# EAGLE schematic imix (EAGLE 7.5.0)
AUTHOR: Shane Leonard; REVISION: 1.2

## Sheet 1 of 8: MCU
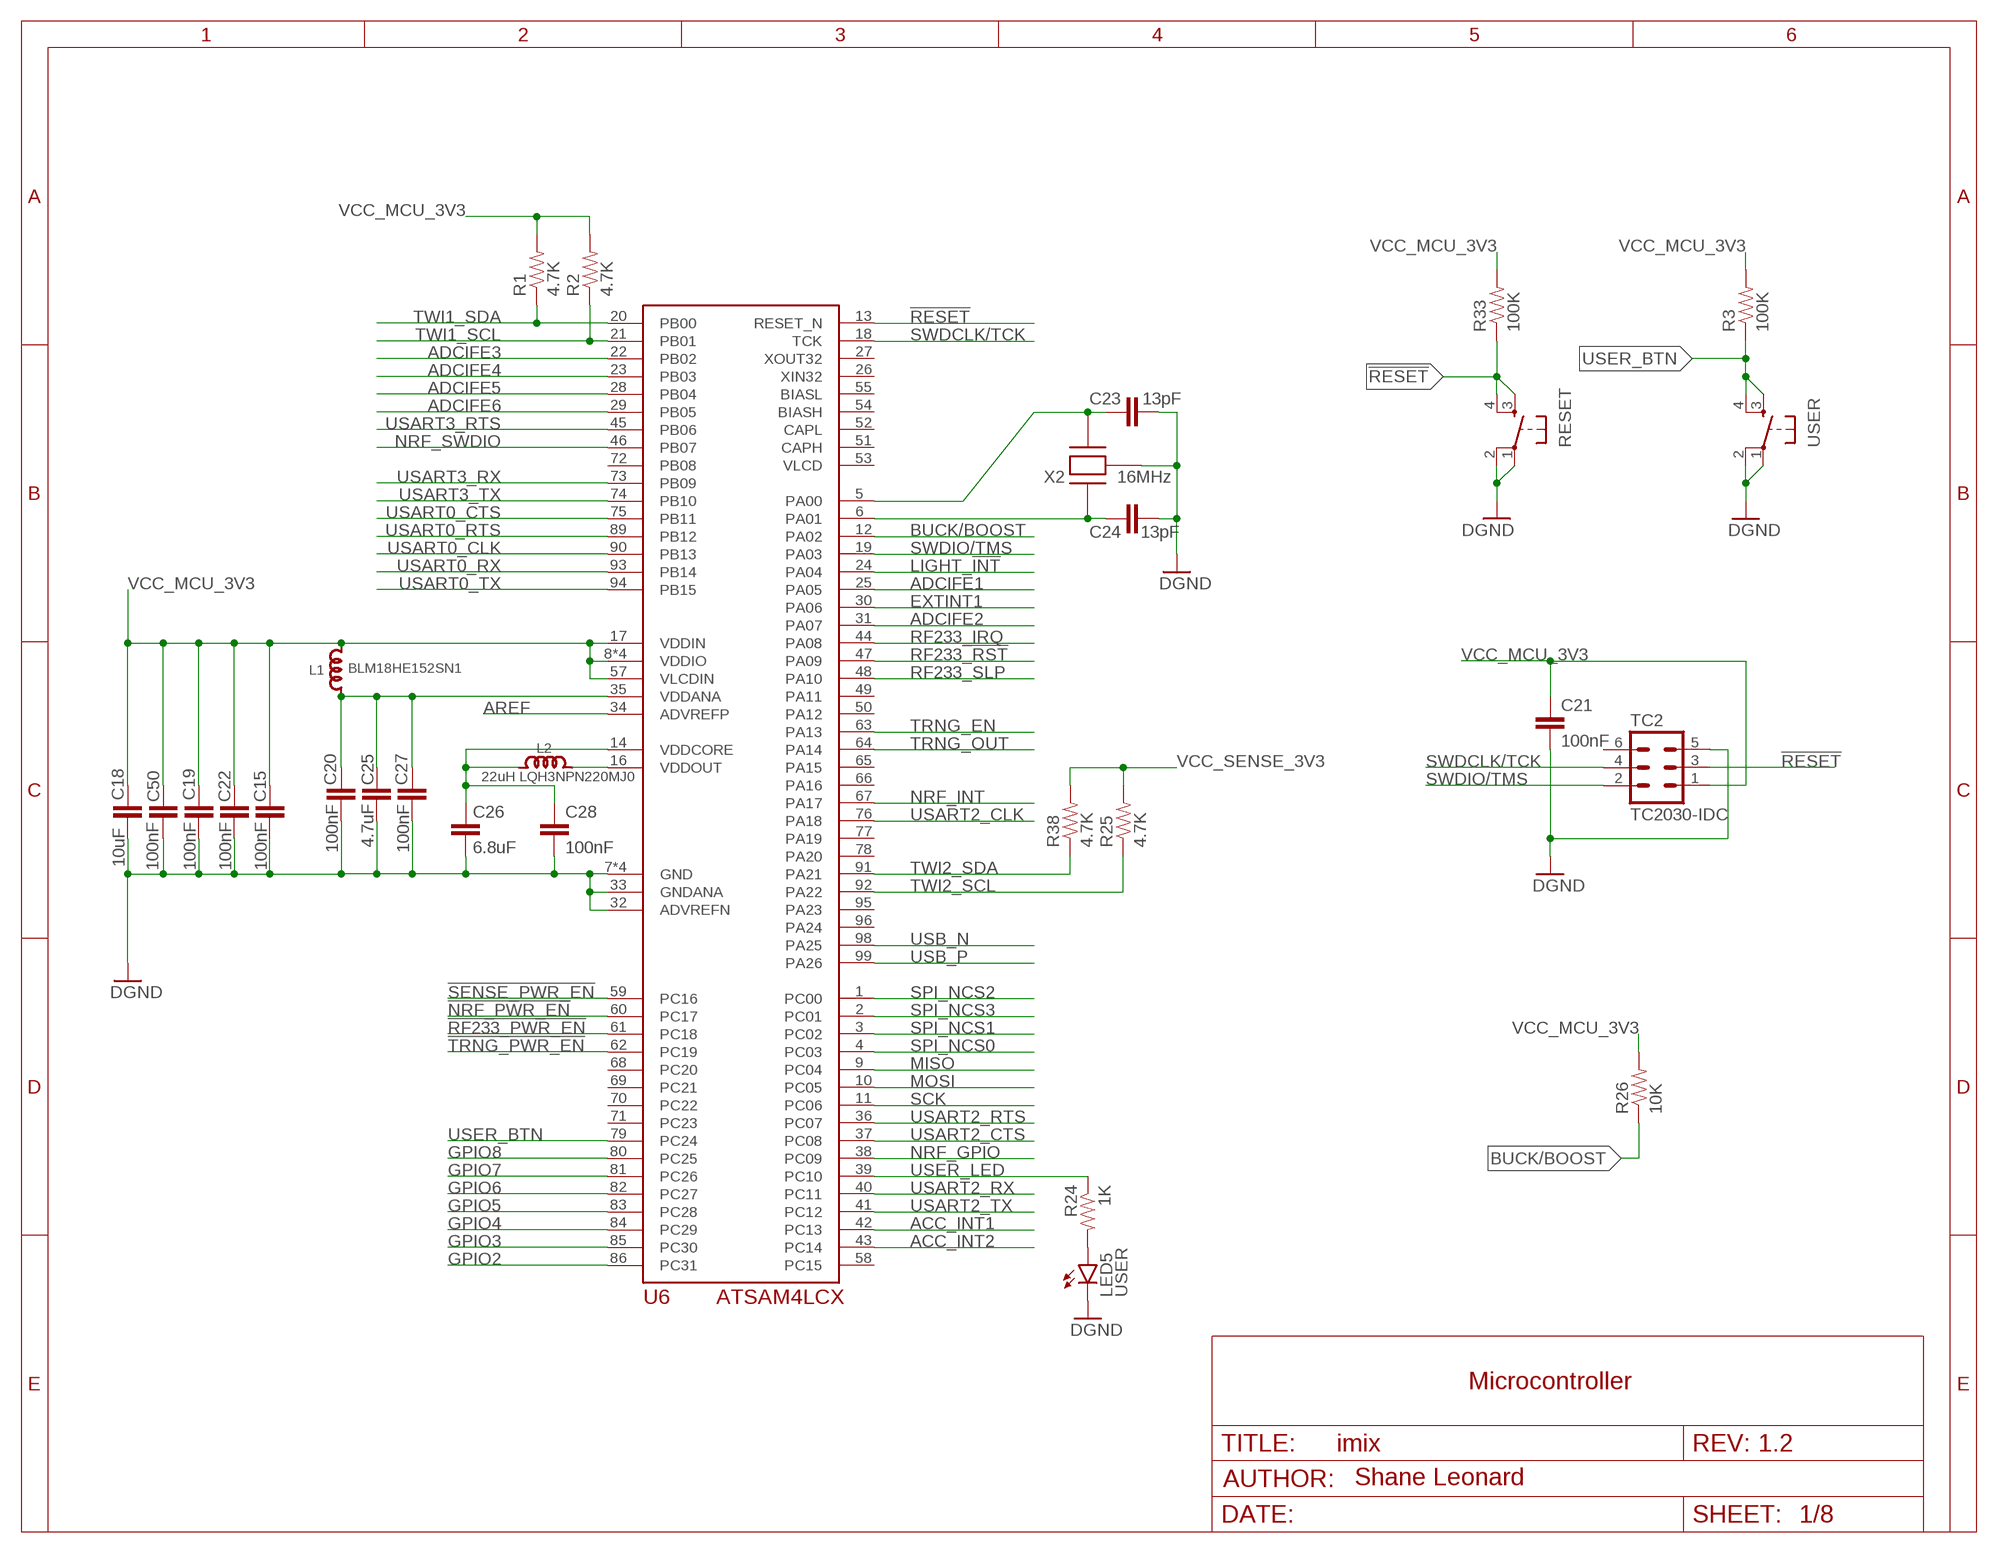
[diagram p0: schematic, sheet 1]

### Parts
C15  100nF  C-EUC0603  [C0603]
C18  10uF  C-EUC0603  [C0603]
C19  100nF  C-EUC0603  [C0603]
C20  100nF  C-EUC0603  [C0603]
C21  100nF  C-EUC0603  [C0603]
C22  100nF  C-EUC0603  [C0603]
C23  13pF  C-EUC0603  [C0603]
C24  13pF  C-EUC0603  [C0603]
C25  4.7uF  C-EUC0603  [C0603]
C26  6.8uF  C-EUC0603  [C0603]
C27  100nF  C-EUC0603  [C0603]
C28  100nF  C-EUC0603  [C0603]
C50  100nF  C-EUC0603  [C0603]
L1  BLM18HE152SN1  L  [L0603]
L2  22uH LQH3NPN220MJ0  L1212  [L1212]
LED5  USER  LED-BLUE0603  [LED-0603]
R1  4.7K  RESISTOR0603-RES  [0603-RES]
R2  4.7K  RESISTOR0603-RES  [0603-RES]
R3  100K  RESISTOR0603-RES  [0603-RES]
R24  1K  RESISTOR0603-RES  [0603-RES]
R25  4.7K  RESISTOR0603-RES  [0603-RES]
R26  10K  RESISTOR0603-RES  [0603-RES]
R33  100K  RESISTOR0603-RES  [0603-RES]
R38  4.7K  RESISTOR0603-RES  [0603-RES]
RESET  TAC_SWITCHSMD  [TACTILE-SWITCH-SMD]
TC2  TC2030-IDC  [TC2030-IDC]
U6  ATSAM4LCX_100  [TQFP100]
USER  TAC_SWITCHSMD  [TACTILE-SWITCH-SMD]
X2  16MHz  XTAL_GROUNDED5X3.2MM  [CTS_405_SERIES]

### Nets
!NRF_PWR_EN: U6.60(PC17) ; also sheet 2,6
!RESET: R33.1 RESET.3 RESET.4 TC2.3 U6.13(RESET_N) ; also sheet 2,5
!RF233_PWR_EN: U6.61(PC18) ; also sheet 2,6
!SENSE_PWR_EN: U6.59(PC16) ; also sheet 2,6
!TRNG_PWR_EN: U6.62(PC19) ; also sheet 6
ACC_INT1: U6.42(PC13) ; also sheet 2,7
ACC_INT2: U6.43(PC14) ; also sheet 2,7
ADCIFE1: U6.25(PA05) ; also sheet 2
ADCIFE2: U6.31(PA07) ; also sheet 2
ADCIFE3: U6.22(PB02) ; also sheet 2
ADCIFE4: U6.23(PB03) ; also sheet 2
ADCIFE5: U6.28(PB04) ; also sheet 2
ADCIFE6: U6.29(PB05) ; also sheet 2
AREF: U6.34(ADVREFP) ; also sheet 2
BUCK/BOOST: R26.1 U6.12(PA02)
EXTINT1: U6.30(PA06) ; also sheet 2
GND: C15.1 C18.1 C19.1 C20.2 C21.2 C22.1 C23.2 C24.2 C25.2 C26.2 C27.2 C28.2 C50.1 LED5.C RESET.1 RESET.2 TC2.5 U6.7(GND) U6.15(GND) U6.32(ADVREFN) U6.33(GNDANA) U6.56(GND) U6.100(GND) USER.1 USER.2 X2.CASE@2(CASE) X2.CASE@4(CASE) ; supply symbol labelled DGND ; also sheet 2,3,4,5,6,7,8
GPIO2: U6.86(PC31) ; also sheet 2
GPIO3: U6.85(PC30) ; also sheet 2
GPIO4: U6.84(PC29) ; also sheet 2
GPIO5: U6.83(PC28) ; also sheet 2
GPIO6: U6.82(PC27) ; also sheet 2
GPIO7: U6.81(PC26) ; also sheet 2
GPIO8: U6.80(PC25) ; also sheet 2
LIGHT_!INT: U6.24(PA04) ; also sheet 2,7
MCU_VOUT3.3: L2.2 U6.16(VDDOUT)
MISO: U6.9(PC04) ; also sheet 2,3
MOSI: U6.10(PC05) ; also sheet 2,3
N$10: C20.1 C25.1 C27.1 L1.1 U6.35(VDDANA)
N$11: C24.1 U6.6(PA01) X2.1
N$12: C26.1 C28.1 L2.1 U6.14(VDDCORE)
N$13: C23.1 U6.5(PA00) X2.3
N$29: LED5.A R24.2
NRF_GPIO: U6.38(PC09) ; also sheet 2,4
NRF_INT: U6.67(PA17) ; also sheet 2,4
NRF_SWDIO: U6.46(PB07) ; also sheet 2,4
RF233_!RST: U6.47(PA09) ; also sheet 2,3
RF233_IRQ: U6.44(PA08) ; also sheet 2,3
RF233_SLP: U6.48(PA10) ; also sheet 2,3
SCK: U6.11(PC06) ; also sheet 2,3
SPI_NCS0: U6.4(PC03) ; also sheet 2
SPI_NCS1: U6.3(PC02) ; also sheet 2
SPI_NCS2: U6.1(PC00) ; also sheet 2
SPI_NCS3: U6.2(PC01) ; also sheet 2,3
SWDCLK/TCK: TC2.4 U6.18(TCK)
SWDIO/TMS: TC2.2 U6.19(PA03)
TRNG_EN: U6.63(PA13) ; also sheet 2,8
TRNG_OUT: U6.64(PA14) ; also sheet 2,8
TWI1_SCL: R2.1 U6.21(PB01) ; also sheet 2
TWI1_SDA: R1.1 U6.20(PB00) ; also sheet 2
TWI2_SCL: R25.1 U6.92(PA22) ; also sheet 2,4,7
TWI2_SDA: R38.1 U6.91(PA21) ; also sheet 2,4,7
USART0_CLK: U6.90(PB13) ; also sheet 2
USART0_CTS: U6.75(PB11) ; also sheet 2
USART0_RTS: U6.89(PB12) ; also sheet 2
USART0_RX: U6.93(PB14) ; also sheet 2
USART0_TX: U6.94(PB15) ; also sheet 2
USART2_CLK: U6.76(PA18) ; also sheet 2,4
USART2_CTS: U6.37(PC08) ; also sheet 2,4
USART2_RTS: U6.36(PC07) ; also sheet 2,4
USART2_RX: U6.40(PC11) ; also sheet 2,4
USART2_TX: U6.41(PC12) ; also sheet 2,4
USART3_RTS: U6.45(PB06) ; also sheet 2,5
USART3_RX: U6.73(PB09) ; also sheet 2,5
USART3_TX: U6.74(PB10) ; also sheet 2,5
USB_N: U6.98(PA25) ; also sheet 5
USB_P: U6.99(PA26) ; also sheet 5
USER_BTN: R3.1 U6.79(PC24) USER.3 USER.4 ; also sheet 2
USER_LED: R24.1 U6.39(PC10) ; also sheet 2
VCC_MCU_3V3 [power]: C15.2 C18.2 C19.2 C21.1 C22.2 C50.2 L1.2 R1.2 R2.2 R3.2 R26.2 R33.2 TC2.1 U6.8(VDDIO) U6.17(VDDIN) U6.57(VLCDIN) U6.87(VDDIO) U6.88(VDDIO) U6.97(VDDIO) ; also sheet 6
VCC_SENSE_3V3 [power]: R25.2 R38.2 ; also sheet 6,7
Unconnected: TC2.6 U6.26(XIN32) U6.27(XOUT32) U6.49(PA11) U6.50(PA12) U6.51(CAPH) U6.52(CAPL) U6.53(VLCD) U6.58(PC15) U6.65(PA15) U6.66(PA16) U6.68(PC20) U6.69(PC21) U6.70(PC22) U6.71(PC23) U6.72(PB08) U6.77(PA19) U6.78(PA20) U6.95(PA23) U6.96(PA24)

## Sheet 2 of 8: HEADERS
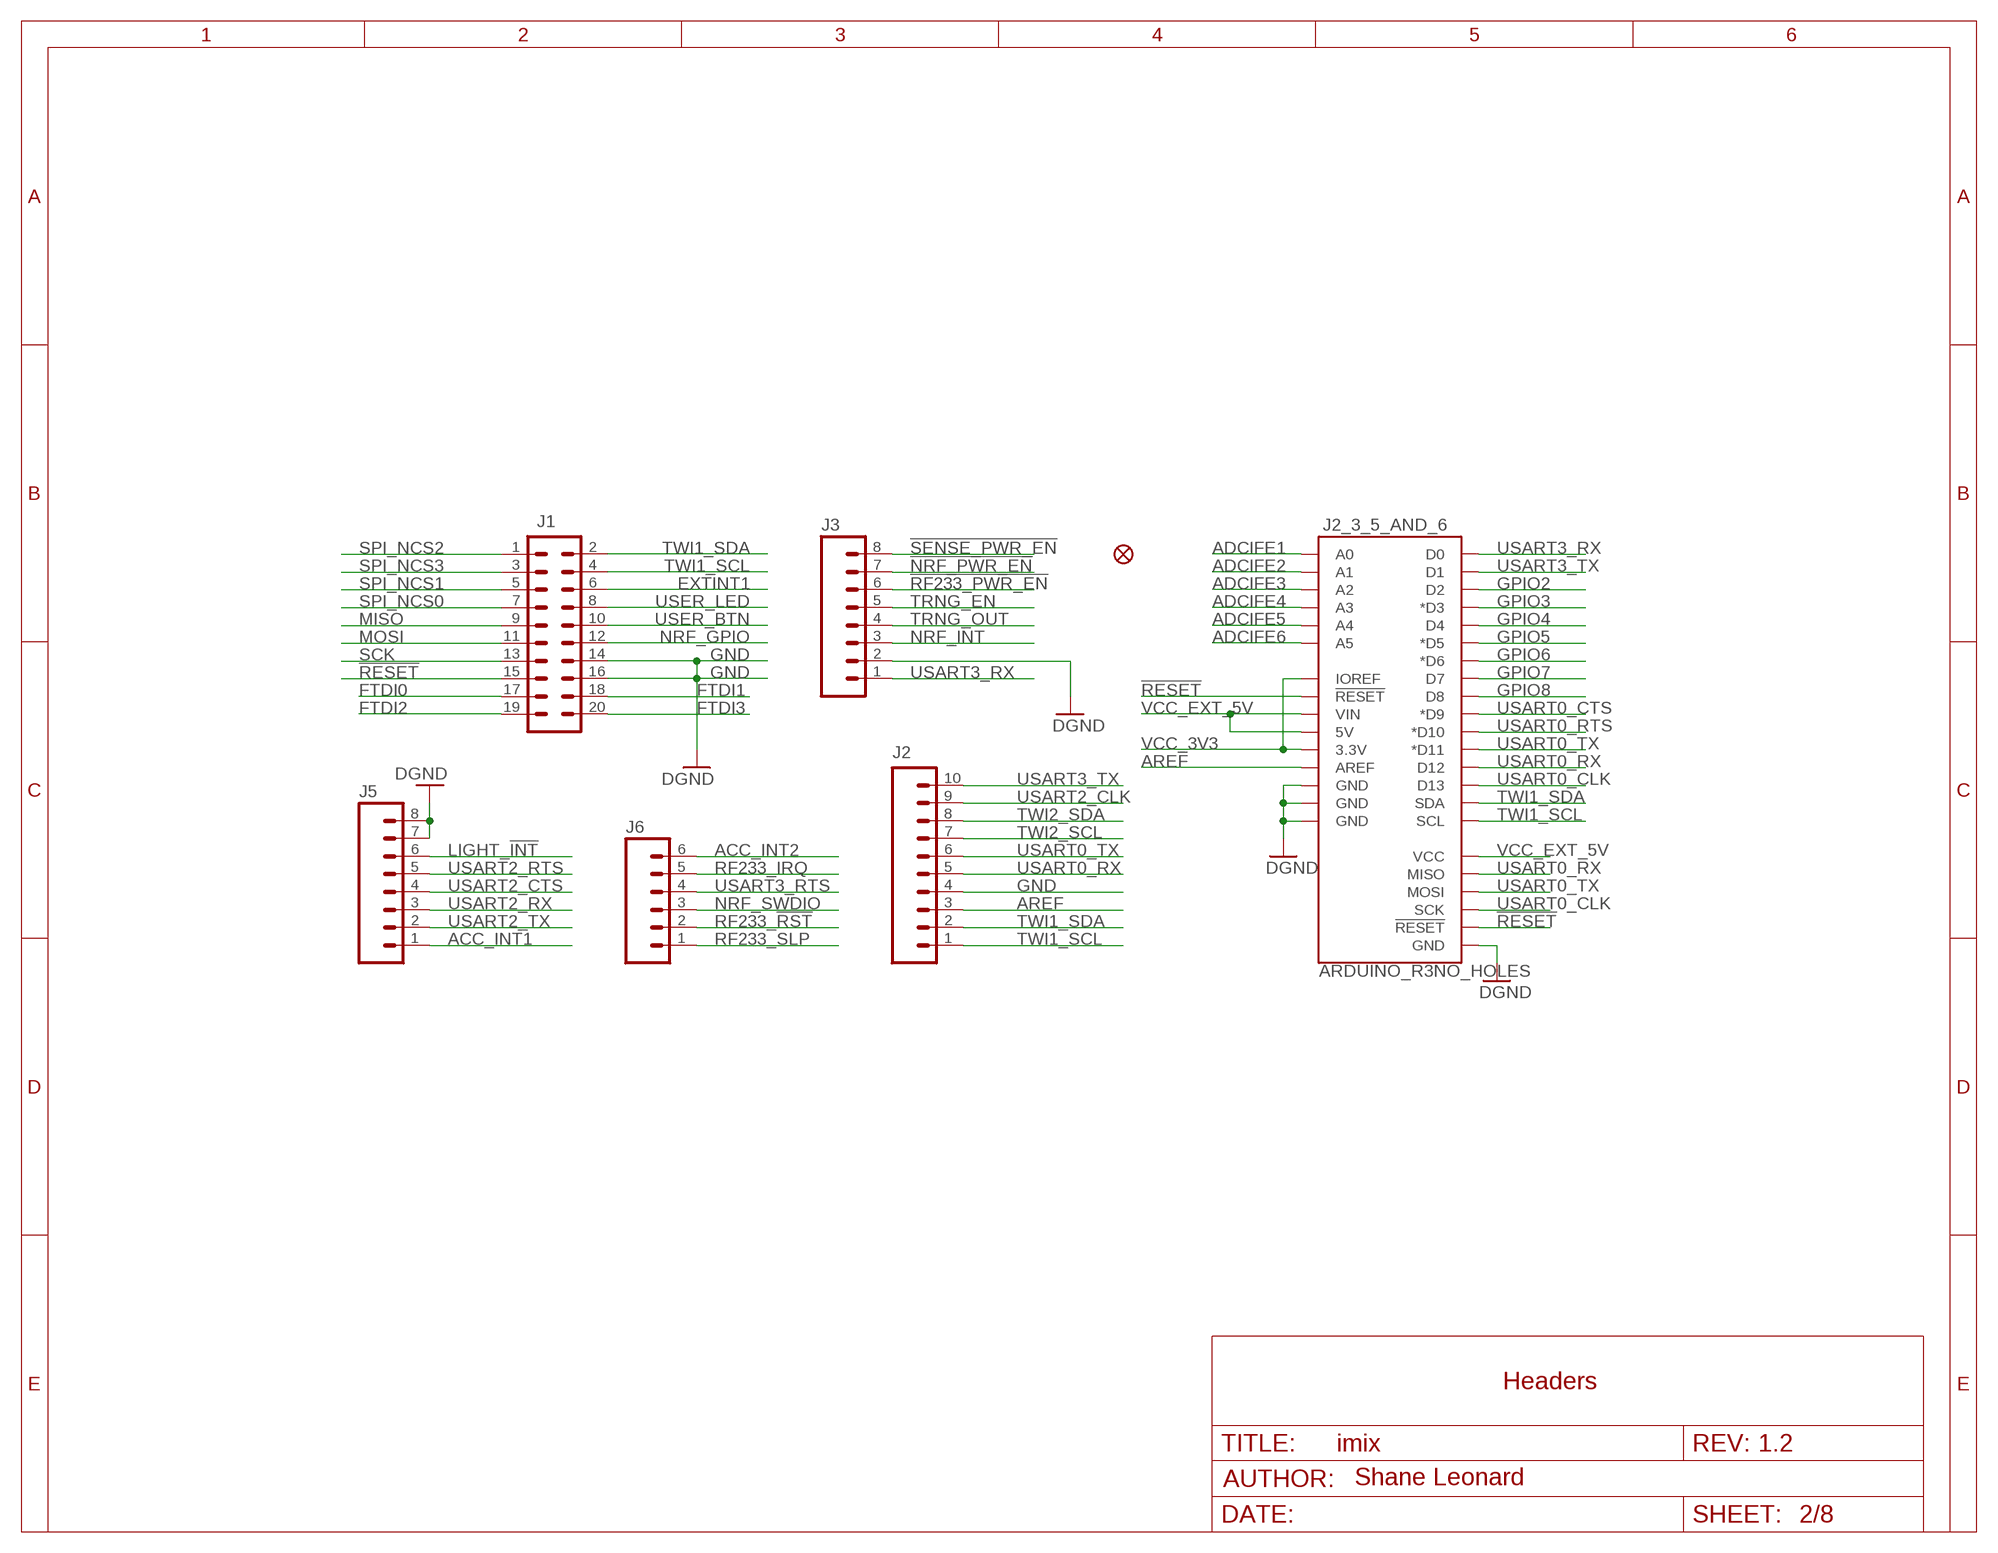
[diagram p1: schematic, sheet 2]

### Parts
F1  FIDUCIAL  [FIDUCIAL]
F2  FIDUCIAL  [FIDUCIAL]
F3  FIDUCIAL  [FIDUCIAL]
F4  FIDUCIAL  [FIDUCIAL]
F5  FIDUCIAL  [FIDUCIAL]
F6  FIDUCIAL  [FIDUCIAL]
F7  FIDUCIAL  [FIDUCIAL]
F8  FIDUCIAL  [FIDUCIAL]
F9  FIDUCIAL  [FIDUCIAL]
F10  FIDUCIAL  [FIDUCIAL]
J1  M10X2ROUND_NOSILK  [2X10_ROUND_NOSILK]
J2  M10NO_SILK_PTH_FEMALE  [1X10_NO_SILK]
J2_3_5_AND_6  ARDUINO_R3NO_HOLES  [ARDUINO_R3_NO_HOLES]
J3  M08NO_SILK_FEMALE_PTH  [1X08_NO_SILK]
J5  M08NO_SILK_FEMALE_PTH  [1X08_NO_SILK]
J6  M06NO_SILK_FEMALE_PTH  [1X06_NO_SILK]

### Nets
!NRF_PWR_EN: J3.7 ; also sheet 1,6
!RESET: J1.15 J2_3_5_AND_6.RESET@1(!RESET!) J2_3_5_AND_6.RESET@2(!RESET!) ; also sheet 1,5
!RF233_PWR_EN: J3.6 ; also sheet 1,6
!SENSE_PWR_EN: J3.8 ; also sheet 1,6
ACC_INT1: J5.1 ; also sheet 1,7
ACC_INT2: J6.6 ; also sheet 1,7
ADCIFE1: J2_3_5_AND_6.A0 ; also sheet 1
ADCIFE2: J2_3_5_AND_6.A1 ; also sheet 1
ADCIFE3: J2_3_5_AND_6.A2 ; also sheet 1
ADCIFE4: J2_3_5_AND_6.A3 ; also sheet 1
ADCIFE5: J2_3_5_AND_6.A4 ; also sheet 1
ADCIFE6: J2_3_5_AND_6.A5 ; also sheet 1
AREF: J2.3 J2_3_5_AND_6.AREF ; also sheet 1
EXTINT1: J1.6 ; also sheet 1
FTDI0 [50ohm]: J1.17 ; also sheet 5
FTDI1 [50ohm]: J1.18 ; also sheet 5
FTDI2 [50ohm]: J1.19 ; also sheet 5
FTDI3 [50ohm]: J1.20 ; also sheet 5
GND: J1.14 J1.16 J2.4 J2_3_5_AND_6.GND@1(GND) J2_3_5_AND_6.GND@2(GND) J2_3_5_AND_6.GND@3(GND) J2_3_5_AND_6.GND@4(GND) J3.2 J5.7 J5.8 ; supply symbol labelled DGND ; also sheet 1,3,4,5,6,7,8
GPIO2: J2_3_5_AND_6.D2 ; also sheet 1
GPIO3: J2_3_5_AND_6.D3(*D3) ; also sheet 1
GPIO4: J2_3_5_AND_6.D4 ; also sheet 1
GPIO5: J2_3_5_AND_6.D5(*D5) ; also sheet 1
GPIO6: J2_3_5_AND_6.D6(*D6) ; also sheet 1
GPIO7: J2_3_5_AND_6.D7 ; also sheet 1
GPIO8: J2_3_5_AND_6.D8 ; also sheet 1
LIGHT_!INT: J5.6 ; also sheet 1,7
MISO: J1.9 ; also sheet 1,3
MOSI: J1.11 ; also sheet 1,3
NRF_GPIO: J1.12 ; also sheet 1,4
NRF_INT: J3.3 ; also sheet 1,4
NRF_SWDIO: J6.3 ; also sheet 1,4
RF233_!RST: J6.2 ; also sheet 1,3
RF233_IRQ: J6.5 ; also sheet 1,3
RF233_SLP: J6.1 ; also sheet 1,3
SCK: J1.13 ; also sheet 1,3
SPI_NCS0: J1.7 ; also sheet 1
SPI_NCS1: J1.5 ; also sheet 1
SPI_NCS2: J1.1 ; also sheet 1
SPI_NCS3: J1.3 ; also sheet 1,3
TRNG_EN: J3.5 ; also sheet 1,8
TRNG_OUT: J3.4 ; also sheet 1,8
TWI1_SCL: J1.4 J2.1 J2_3_5_AND_6.SCL ; also sheet 1
TWI1_SDA: J1.2 J2.2 J2_3_5_AND_6.SDA ; also sheet 1
TWI2_SCL: J2.7 ; also sheet 1,4,7
TWI2_SDA: J2.8 ; also sheet 1,4,7
USART0_CLK: J2_3_5_AND_6.D13 J2_3_5_AND_6.SCK ; also sheet 1
USART0_CTS: J2_3_5_AND_6.D9(*D9) ; also sheet 1
USART0_RTS: J2_3_5_AND_6.D10(*D10) ; also sheet 1
USART0_RX: J2.5 J2_3_5_AND_6.D12 J2_3_5_AND_6.MISO ; also sheet 1
USART0_TX: J2.6 J2_3_5_AND_6.D11(*D11) J2_3_5_AND_6.MOSI ; also sheet 1
USART2_CLK: J2.9 ; also sheet 1,4
USART2_CTS: J5.4 ; also sheet 1,4
USART2_RTS: J5.5 ; also sheet 1,4
USART2_RX: J5.3 ; also sheet 1,4
USART2_TX: J5.2 ; also sheet 1,4
USART3_RTS: J6.4 ; also sheet 1,5
USART3_RX: J2_3_5_AND_6.D0 J3.1 ; also sheet 1,5
USART3_TX: J2.10 J2_3_5_AND_6.D1 ; also sheet 1,5
USER_BTN: J1.10 ; also sheet 1
USER_LED: J1.8 ; also sheet 1
VCC_3V3 [power]: J2_3_5_AND_6.3.3V J2_3_5_AND_6.IOREF ; also sheet 5,6
VCC_EXT_5V [power]: J2_3_5_AND_6.5V J2_3_5_AND_6.VCC J2_3_5_AND_6.VIN ; also sheet 6

## Sheet 3 of 8: ZigBee
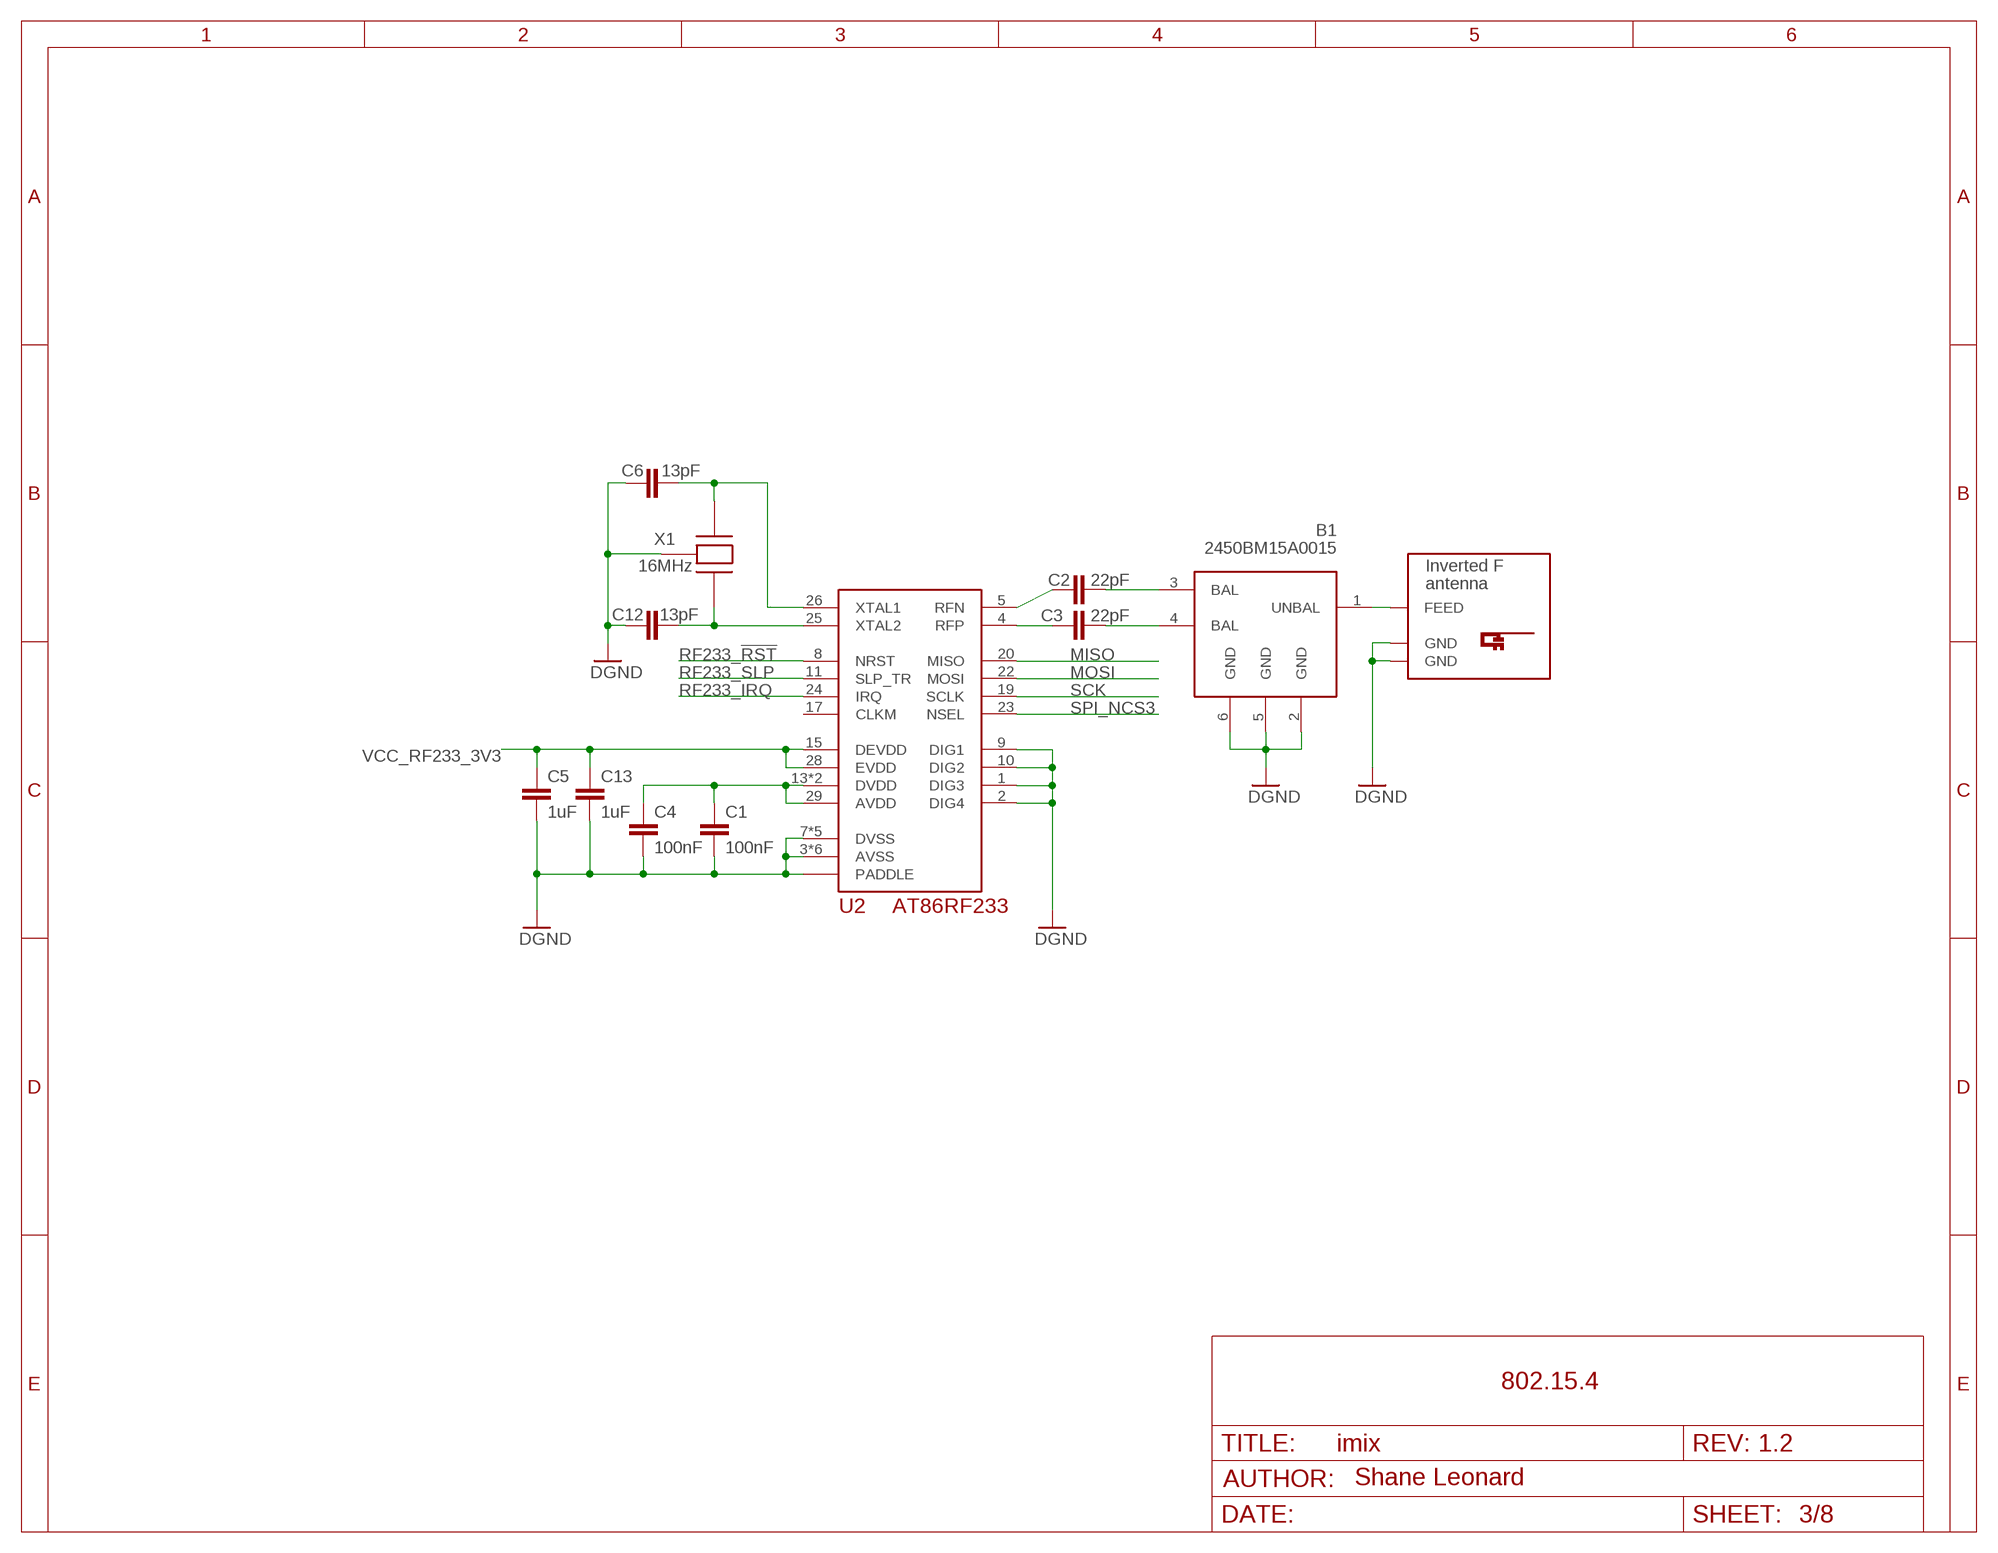
[diagram p2: schematic, sheet 3]

### Parts
B1  2450BM15A0015  [BALUN0805]
C1  100nF  C-EUC0603  [C0603]
C2  22pF  C-EUC0603  [C0603]
C3  22pF  C-EUC0603  [C0603]
C4  100nF  C-EUC0603  [C0603]
C5  1uF  C-EUC0603  [C0603]
C6  13pF  C-EUC0603  [C0603]
C12  13pF  C-EUC0603  [C0603]
C13  1uF  C-EUC0603  [C0603]
U2  AT86RF233  [32QN2]
U$1  INVERTED_F_ANTENNA-2  [DN007-2]
X1  16MHz  XTAL_GROUNDED5X3.2MM  [CTS_405_SERIES]

### Nets
GND: B1.2(GND) B1.5(GND) B1.6(GND) C1.2 C4.2 C5.2 C6.1 C12.1 C13.2 U2.1(DIG3) U2.2(DIG4) U2.3(AVSS) U2.6(AVSS) U2.7(DVSS) U2.9(DIG1) U2.10(DIG2) U2.12(DVSS) U2.16(DVSS) U2.18(DVSS) U2.21(DVSS) U2.27(AVSS) U2.30(AVSS) U2.31(AVSS) U2.32(AVSS) U2.PADDLE U$1.GND U$1.GND@1(GND) X1.CASE@2(CASE) X1.CASE@4(CASE) ; supply symbol labelled DGND ; also sheet 1,2,4,5,6,7,8
MISO: U2.20(MISO) ; also sheet 1,2
MOSI: U2.22(MOSI) ; also sheet 1,2
N$1 [50ohm]: C2.2 U2.5(RFN)
N$2: C1.1 C4.1 U2.13(DVDD) U2.14(DVDD) U2.29(AVDD)
N$4: C6.2 U2.26(XTAL1) X1.1
N$17 [50ohm]: C3.2 U2.4(RFP)
N$22 [50ohm]: B1.3(BAL) C2.1
N$40: C12.2 U2.25(XTAL2) X1.3
N$41 [50ohm]: B1.4(BAL) C3.1
N$42 [50ohm]: B1.1(UNBAL) U$1.FEED
RF233_!RST: U2.8(NRST) ; also sheet 1,2
RF233_IRQ: U2.24(IRQ) ; also sheet 1,2
RF233_SLP: U2.11(SLP_TR) ; also sheet 1,2
SCK: U2.19(SCLK) ; also sheet 1,2
SPI_NCS3: U2.23(NSEL) ; also sheet 1,2
VCC_RF233_3V3 [power]: C5.1 C13.1 U2.15(DEVDD) U2.28(EVDD) ; also sheet 6
Unconnected: U2.17(CLKM)

## Sheet 4 of 8: BLE
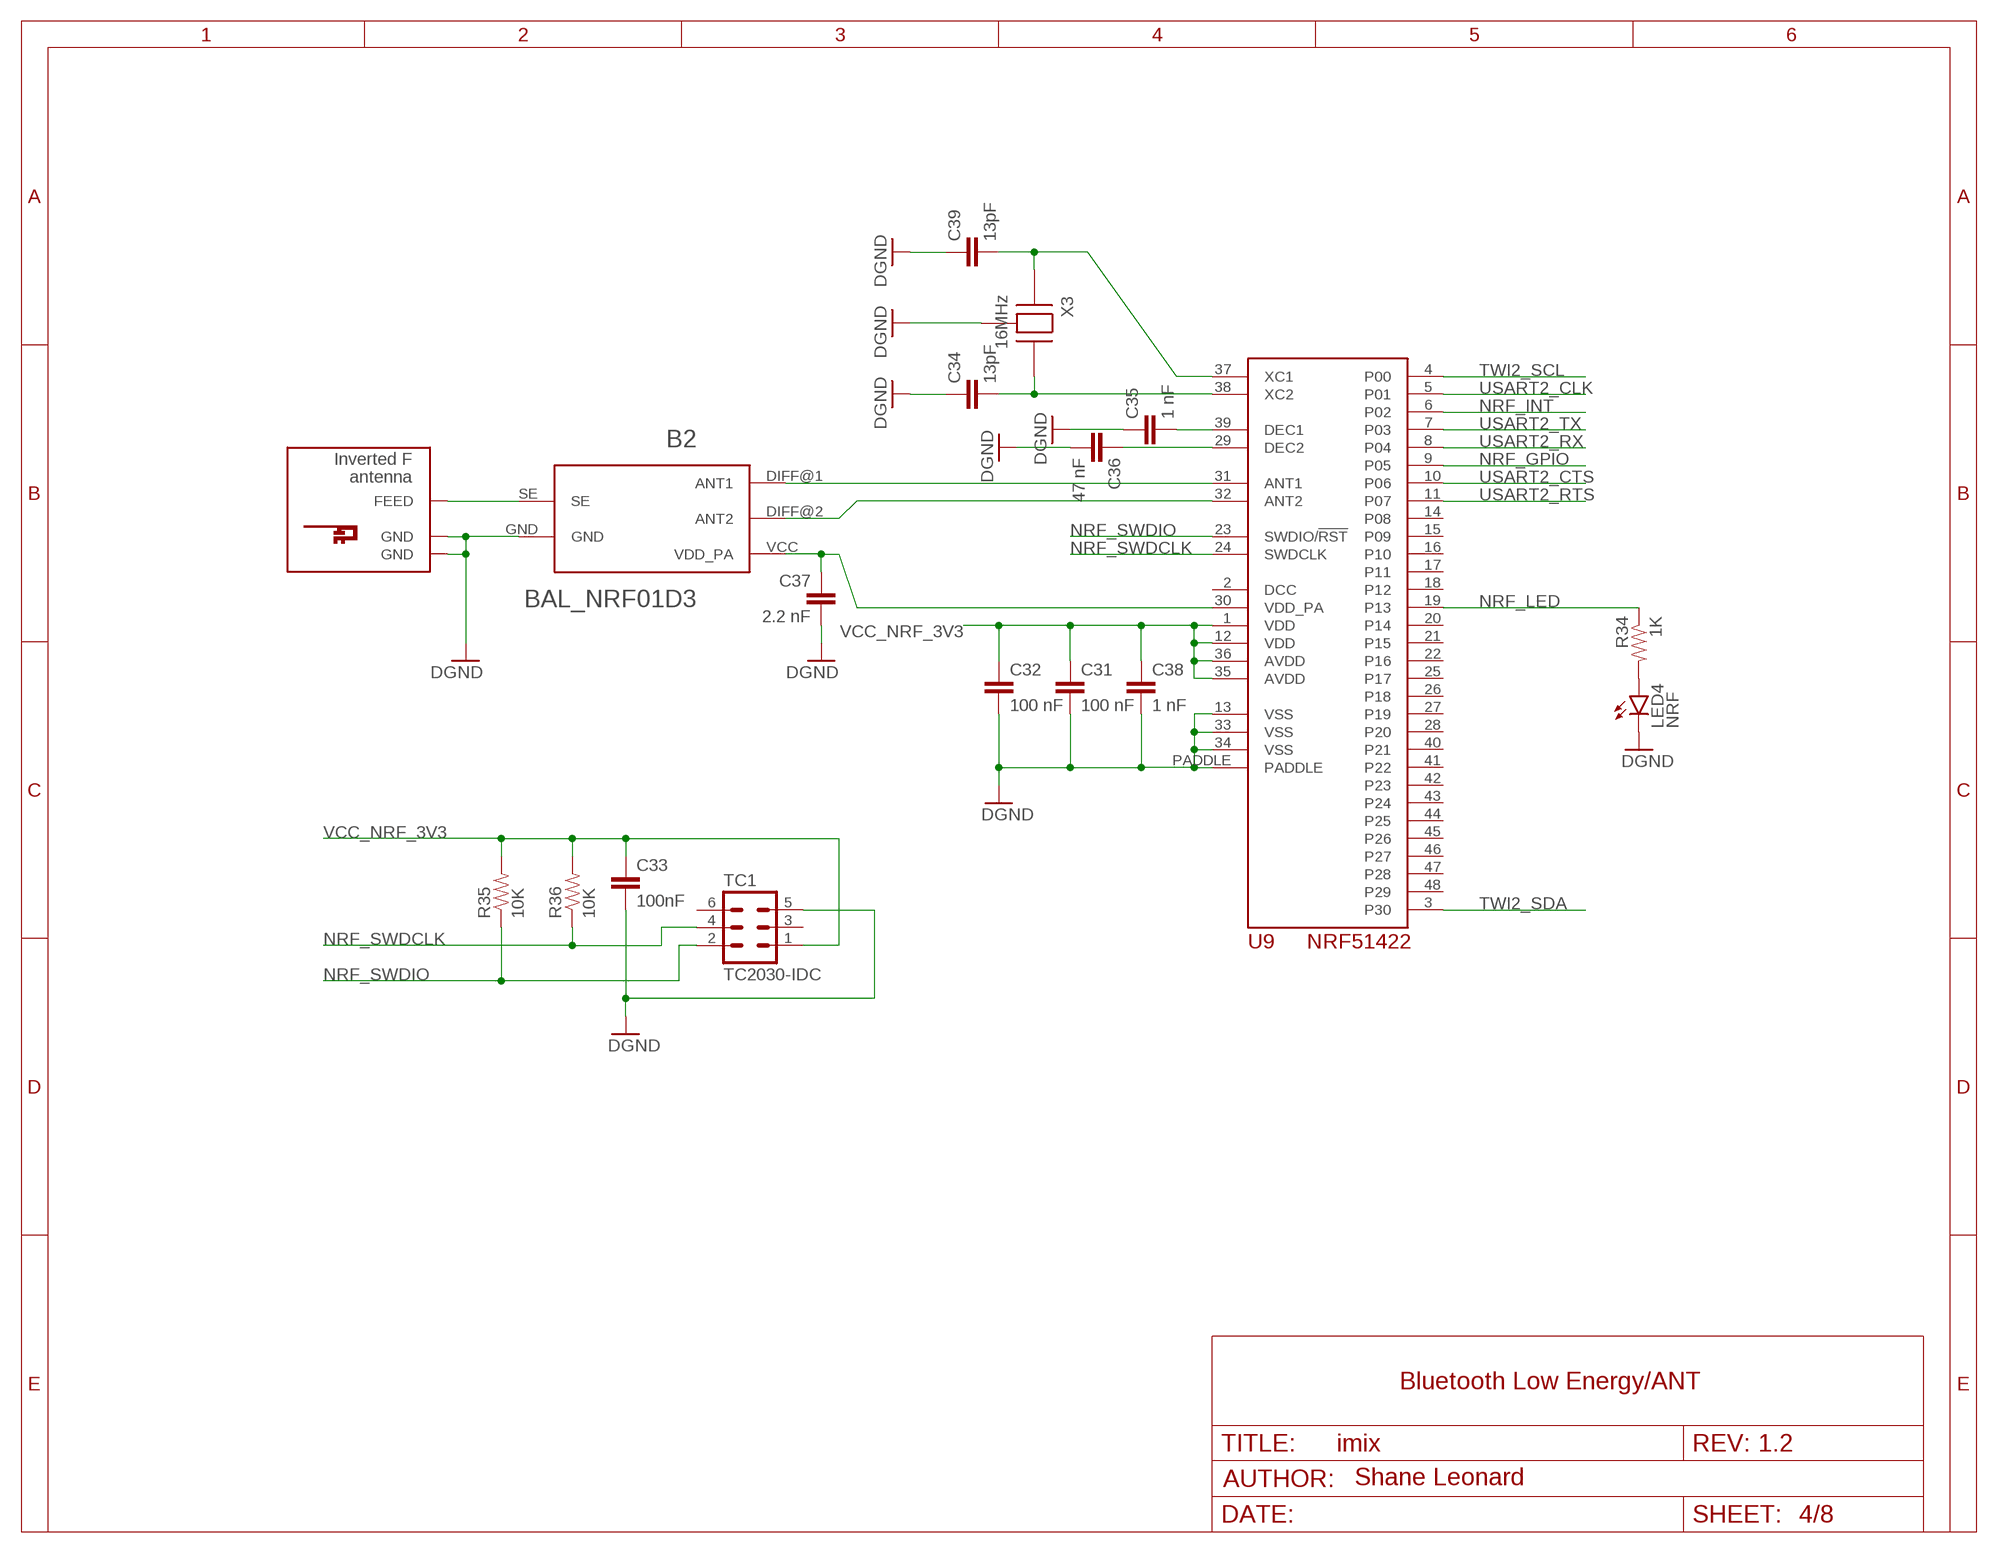
[diagram p3: schematic, sheet 4]

### Parts
B2  BAL_NRF01D3  [BAL_NRF01D3]
C31  100 nF  C-EUC0603  [C0603]
C32  100 nF  C-EUC0603  [C0603]
C33  100nF  C-EUC0603  [C0603]
C34  13pF  C-EUC0603  [C0603]
C35  1 nF  C-EUC0603  [C0603]
C36  47 nF  C-EUC0603  [C0603]
C37  2.2 nF  C-EUC0603  [C0603]
C38  1 nF  C-EUC0603  [C0603]
C39  13pF  C-EUC0603  [C0603]
LED4  NRF  LED-BLUE0603  [LED-0603]
R34  1K  RESISTOR0603-RES  [0603-RES]
R35  10K  RESISTOR0603-RES  [0603-RES]
R36  10K  RESISTOR0603-RES  [0603-RES]
TC1  TC2030-IDC  [TC2030-IDC]
U9  NRF51422  NRF51822  [QFN48_6X6]
U$4  INVERTED_F_ANTENNA-2  [DN007-2]
X3  16MHz  XTAL_GROUNDED5X3.2MM  [CTS_405_SERIES]

### Nets
GND: B2.GND C31.2 C32.2 C33.2 C34.1 C35.1 C36.2 C37.2 C38.2 C39.1 LED4.C TC1.5 U9.13(VSS) U9.33(VSS) U9.34(VSS) U9.PADDLE U$4.GND U$4.GND@1(GND) X3.CASE@2(CASE) X3.CASE@4(CASE) ; supply symbol labelled DGND ; also sheet 1,2,3,5,6,7,8
N$5 [50ohm]: B2.SE U$4.FEED
N$6: B2.VCC(VDD_PA) C37.1 U9.30(VDD_PA)
N$7: C34.2 U9.38(XC2) X3.3
N$9: C39.2 U9.37(XC1) X3.1
N$15: C35.2 U9.39(DEC1)
N$19: C36.1 U9.29(DEC2)
N$21 [50ohm]: B2.DIFF@1(ANT1) U9.31(ANT1)
N$23 [50ohm]: B2.DIFF@2(ANT2) U9.32(ANT2)
N$75: LED4.A R34.2
NRF_GPIO: U9.9(P05) ; also sheet 1,2
NRF_INT: U9.6(P02) ; also sheet 1,2
NRF_LED: R34.1 U9.19(P13)
NRF_SWDCLK: R36.1 TC1.4 U9.24(SWDCLK)
NRF_SWDIO: R35.1 TC1.2 U9.23(SWDIO/!RST) ; also sheet 1,2
TWI2_SCL: U9.4(P00) ; also sheet 1,2,7
TWI2_SDA: U9.3(P30) ; also sheet 1,2,7
USART2_CLK: U9.5(P01) ; also sheet 1,2
USART2_CTS: U9.10(P06) ; also sheet 1,2
USART2_RTS: U9.11(P07) ; also sheet 1,2
USART2_RX: U9.8(P04) ; also sheet 1,2
USART2_TX: U9.7(P03) ; also sheet 1,2
VCC_NRF_3V3 [power]: C31.1 C32.1 C33.1 C38.1 R35.2 R36.2 TC1.1 U9.1(VDD) U9.12(VDD) U9.35(AVDD) U9.36(AVDD) ; also sheet 6
Unconnected: TC1.3 TC1.6 U9.2(DCC) U9.14(P08) U9.15(P09) U9.16(P10) U9.17(P11) U9.18(P12) U9.20(P14) U9.21(P15) U9.22(P16) U9.25(P17) U9.26(P18) U9.27(P19) U9.28(P20) U9.40(P21) U9.41(P22) U9.42(P23) U9.43(P24) U9.44(P25) U9.45(P26) U9.46(P27) U9.47(P28) U9.48(P29)

## Sheet 5 of 8: USB
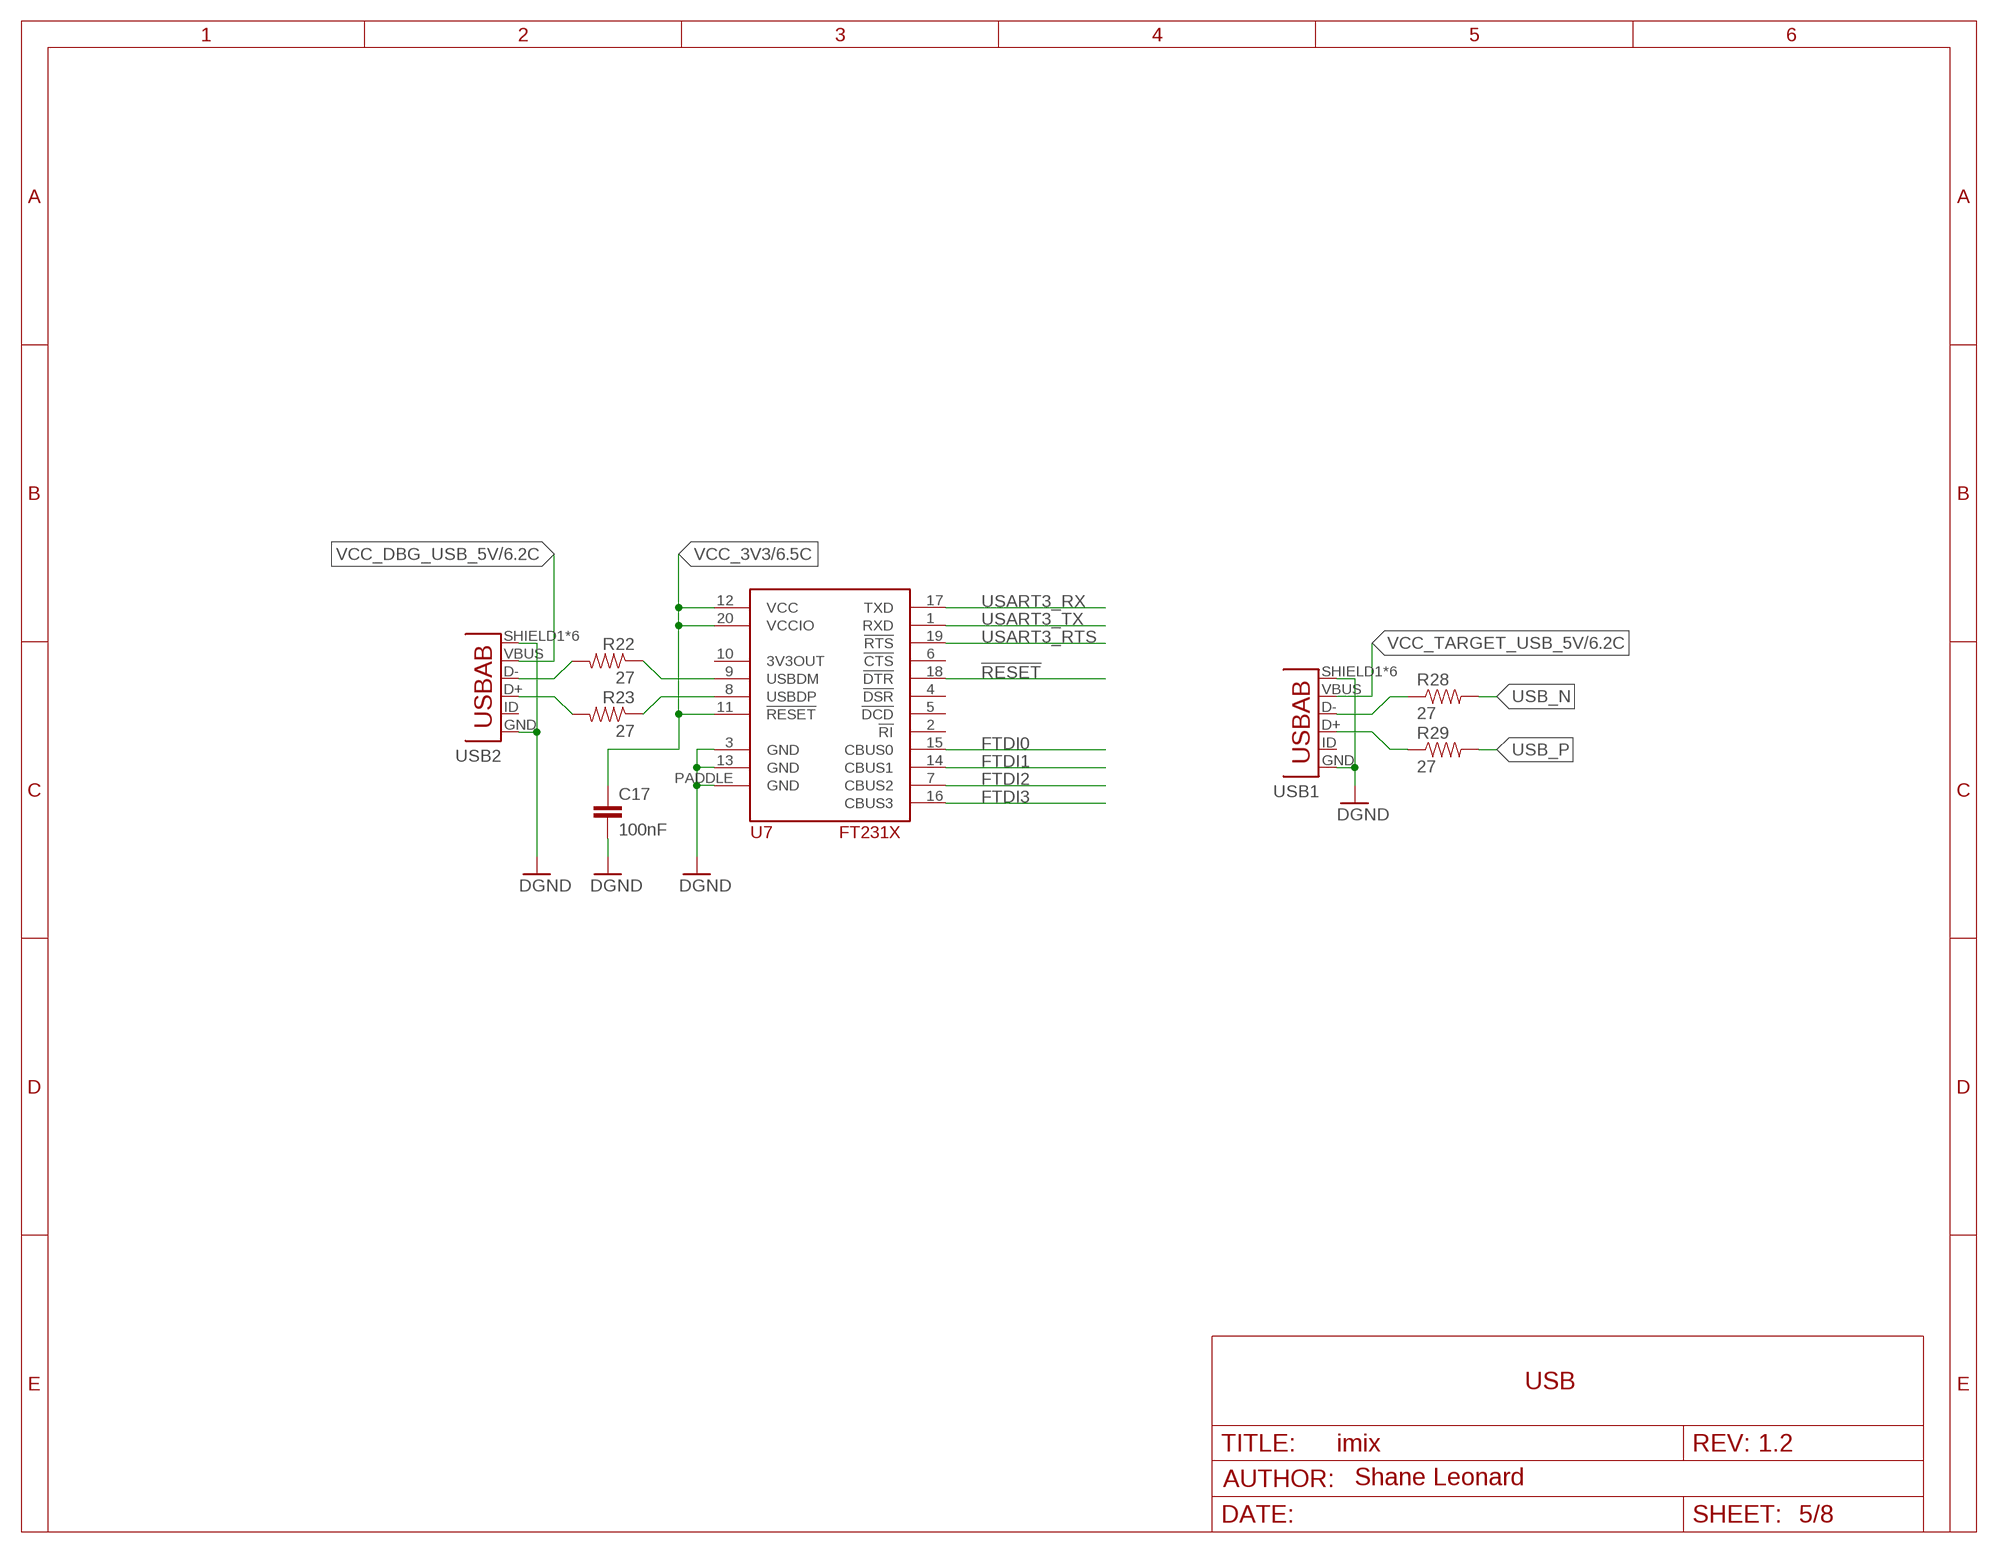
[diagram p4: schematic, sheet 5]

### Parts
C17  100nF  C-EUC0603  [C0603]
R22  27  RESISTOR0603-RES  [0603-RES]
R23  27  RESISTOR0603-RES  [0603-RES]
R28  27  RESISTOR0603-RES  [0603-RES]
R29  27  RESISTOR0603-RES  [0603-RES]
U7  FT231X  [QFN20]
USB1  USB-AB  [USB-AB-MICRO-SMD]
USB2  USB-AB  [USB-AB-MICRO-SMD]

### Nets
!RESET: U7.18(!DTR) ; also sheet 1,2
FTDI0 [50ohm]: U7.15(CBUS0) ; also sheet 2
FTDI1 [50ohm]: U7.14(CBUS1) ; also sheet 2
FTDI2 [50ohm]: U7.7(CBUS2) ; also sheet 2
FTDI3 [50ohm]: U7.16(CBUS3) ; also sheet 2
GND: C17.2 U7.3(GND) U7.13(GND) U7.PADDLE(GND) USB1.GND USB1.SHIELD1(SHIELD) USB1.SHIELD2(SHIELD) USB1.SHIELD3(SHIELD) USB1.SHIELD4(SHIELD) USB1.SHIELD5(SHIELD) USB1.SHIELD6(SHIELD) USB2.GND USB2.SHIELD1(SHIELD) USB2.SHIELD2(SHIELD) USB2.SHIELD3(SHIELD) USB2.SHIELD4(SHIELD) USB2.SHIELD5(SHIELD) USB2.SHIELD6(SHIELD) ; supply symbol labelled DGND ; also sheet 1,2,3,4,6,7,8
N$3: R28.1 USB1.D-
N$20: R22.2 USB2.D-
N$24: R22.1 U7.9(USBDM)
N$26: R23.2 USB2.D+
N$30: R23.1 U7.8(USBDP)
N$34: R29.1 USB1.D+
USART3_RTS: U7.19(!RTS) ; also sheet 1,2
USART3_RX: U7.17(TXD) ; also sheet 1,2
USART3_TX: U7.1(RXD) ; also sheet 1,2
USB_N: R28.2 ; also sheet 1
USB_P: R29.2 ; also sheet 1
VCC_3V3 [power]: C17.1 U7.11(!RESET) U7.12(VCC) U7.20(VCCIO) ; also sheet 2,6
VCC_DBG_USB_5V [power]: USB2.VBUS ; also sheet 6
VCC_TARGET_USB_5V [power]: USB1.VBUS ; also sheet 6
Unconnected: U7.2(!RI) U7.4(!DSR) U7.5(!DCD) U7.6(!CTS) U7.10(3V3OUT) USB1.ID(USBID) USB2.ID(USBID)

## Sheet 6 of 8: POWER
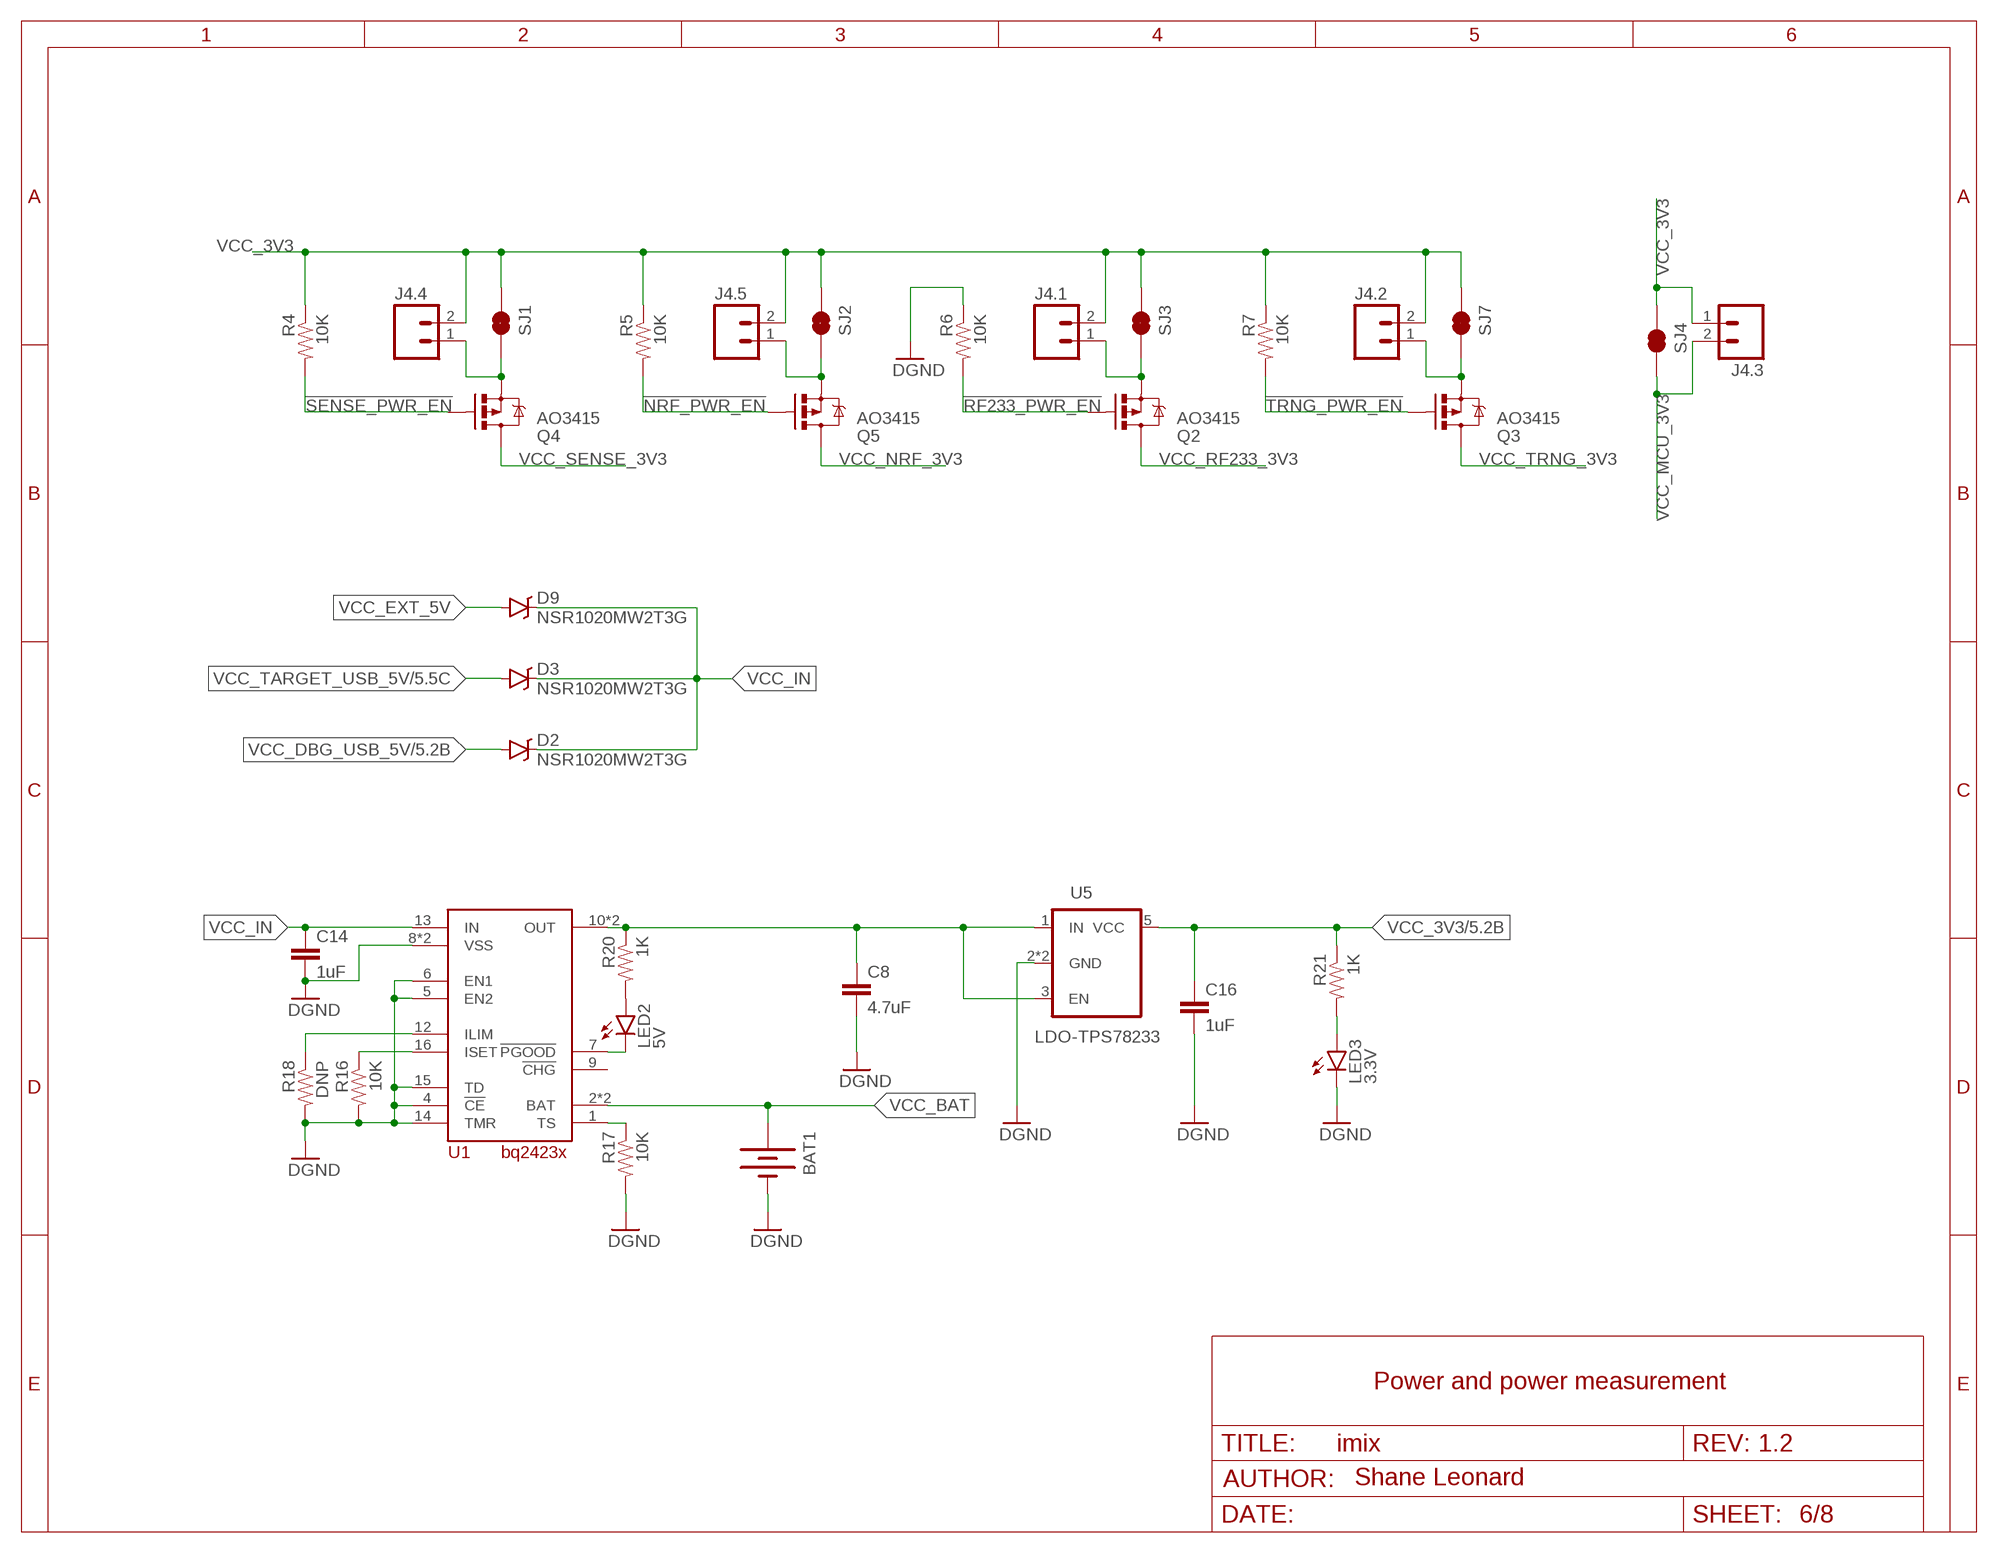
[diagram p5: schematic, sheet 6]

### Parts
BAT1  BATTERY18650  [BATTERY_18650-HOLDER]
C8  4.7uF  C-EUC0603  [C0603]
C14  1uF  C-EUC0603  [C0603]
C16  1uF  C-EUC0603  [C0603]
D2  NSR1020MW2T3G  BAT20JFILM  [SOD-323]
D3  NSR1020MW2T3G  BAT20JFILM  [SOD-323]
D9  NSR1020MW2T3G  BAT20JFILM  [SOD-323]
J4.1  M02PTH  [1X02]
J4.2  M02PTH  [1X02]
J4.3  M02PTH  [1X02]
J4.4  M02PTH  [1X02]
J4.5  M02PTH  [1X02]
LED2  5V  LED-BLUE0603  [LED-0603]
LED3  3.3V  LED-GREEN0603  [LED-0603]
Q2  AO3415  MOSFET-PCHANNELDMG2307L  [SOT23-3]
Q3  AO3415  MOSFET-PCHANNELDMG2307L  [SOT23-3]
Q4  AO3415  MOSFET-PCHANNELDMG2307L  [SOT23-3]
Q5  AO3415  MOSFET-PCHANNELDMG2307L  [SOT23-3]
R4  10K  RESISTOR0603-RES  [0603-RES]
R5  10K  RESISTOR0603-RES  [0603-RES]
R6  10K  RESISTOR0603-RES  [0603-RES]
R7  10K  RESISTOR0603-RES  [0603-RES]
R16  10K  RESISTOR0603-RES  [0603-RES]
R17  10K  RESISTOR0603-RES  [0603-RES]
R18  DNP  RESISTOR0603-RES  [0603-RES]
R20  1K  RESISTOR0603-RES  [0603-RES]
R21  1K  RESISTOR0603-RES  [0603-RES]
SJ1  JUMPER-PAD-2-NC_BY_TRACE  [PAD-JUMPER-2-NC_BY_TRACE_YES_SILK]
SJ2  JUMPER-PAD-2-NC_BY_TRACE  [PAD-JUMPER-2-NC_BY_TRACE_YES_SILK]
SJ3  JUMPER-PAD-2-NC_BY_TRACE  [PAD-JUMPER-2-NC_BY_TRACE_YES_SILK]
SJ4  JUMPER-PAD-2-NC_BY_TRACE  [PAD-JUMPER-2-NC_BY_TRACE_YES_SILK]
SJ7  JUMPER-PAD-2-NC_BY_TRACE  [PAD-JUMPER-2-NC_BY_TRACE_YES_SILK]
U1  BQ2423X  [QFP16_3X3]
U5  LDO-TPS78233  [SOT23-5]

### Nets
!NRF_PWR_EN: Q5.1(G) R5.2 ; also sheet 1,2
!RF233_PWR_EN: Q2.1(G) R6.2 ; also sheet 1,2
!SENSE_PWR_EN: Q4.1(G) R4.2 ; also sheet 1,2
!TRNG_PWR_EN: Q3.1(G) R7.2 ; also sheet 1
GND: BAT1.GND@1(-) C8.2 C14.2 C16.2 LED3.C R6.1 R16.2 R17.2 R18.2 U1.4(!CE) U1.5(EN2) U1.6(EN1) U1.8(VSS) U1.14(TMR) U1.15(TD) U1.PAD(VSS) U5.2(GND) U5.4(GND) ; supply symbol labelled DGND ; also sheet 1,2,3,4,5,7,8
N$14 [power]: J4.2.1 Q3.2(S) SJ7.2
N$18 [power]: J4.4.1 Q4.2(S) SJ1.2
N$36 [power]: J4.5.1 Q5.2(S) SJ2.2
N$37 [power]: J4.1.1 Q2.2(S) SJ3.2
N$38: LED3.A R21.2
N$47: LED2.C U1.7(!PGOOD)
N$49: LED2.A R20.2
N$53: R17.1 U1.1(TS)
N$57: R18.1 U1.12(ILIM)
N$58: R16.1 U1.16(ISET)
VCC_3V3 [power]: C16.1 J4.1.2 J4.2.2 J4.3.1 J4.4.2 J4.5.2 R4.1 R5.1 R7.1 R21.1 SJ1.1 SJ2.1 SJ3.1 SJ4.1 SJ7.1 U5.5(VCC) ; also sheet 2,5
VCC_BAT [power]: BAT1.PWR@1(+) U1.2(BAT) U1.3(BAT)
VCC_DBG_USB_5V [power]: D2.A ; also sheet 5
VCC_EXT_5V [power]: D9.A ; also sheet 2
VCC_IN [power]: C14.1 D2.C D3.C D9.C U1.13(IN)
VCC_LDO [power]: C8.1 R20.1 U1.10(OUT) U1.11(OUT) U5.1(IN) U5.3(EN)
VCC_MCU_3V3 [power]: J4.3.2 SJ4.2 ; also sheet 1
VCC_NRF_3V3 [power]: Q5.3(D) ; also sheet 4
VCC_RF233_3V3 [power]: Q2.3(D) ; also sheet 3
VCC_SENSE_3V3 [power]: Q4.3(D) ; also sheet 1,7
VCC_TARGET_USB_5V [power]: D3.A ; also sheet 5
VCC_TRNG_3V3 [power]: Q3.3(D) ; also sheet 8
Unconnected: U1.9(!CHG)

## Sheet 7 of 8: SENSORS
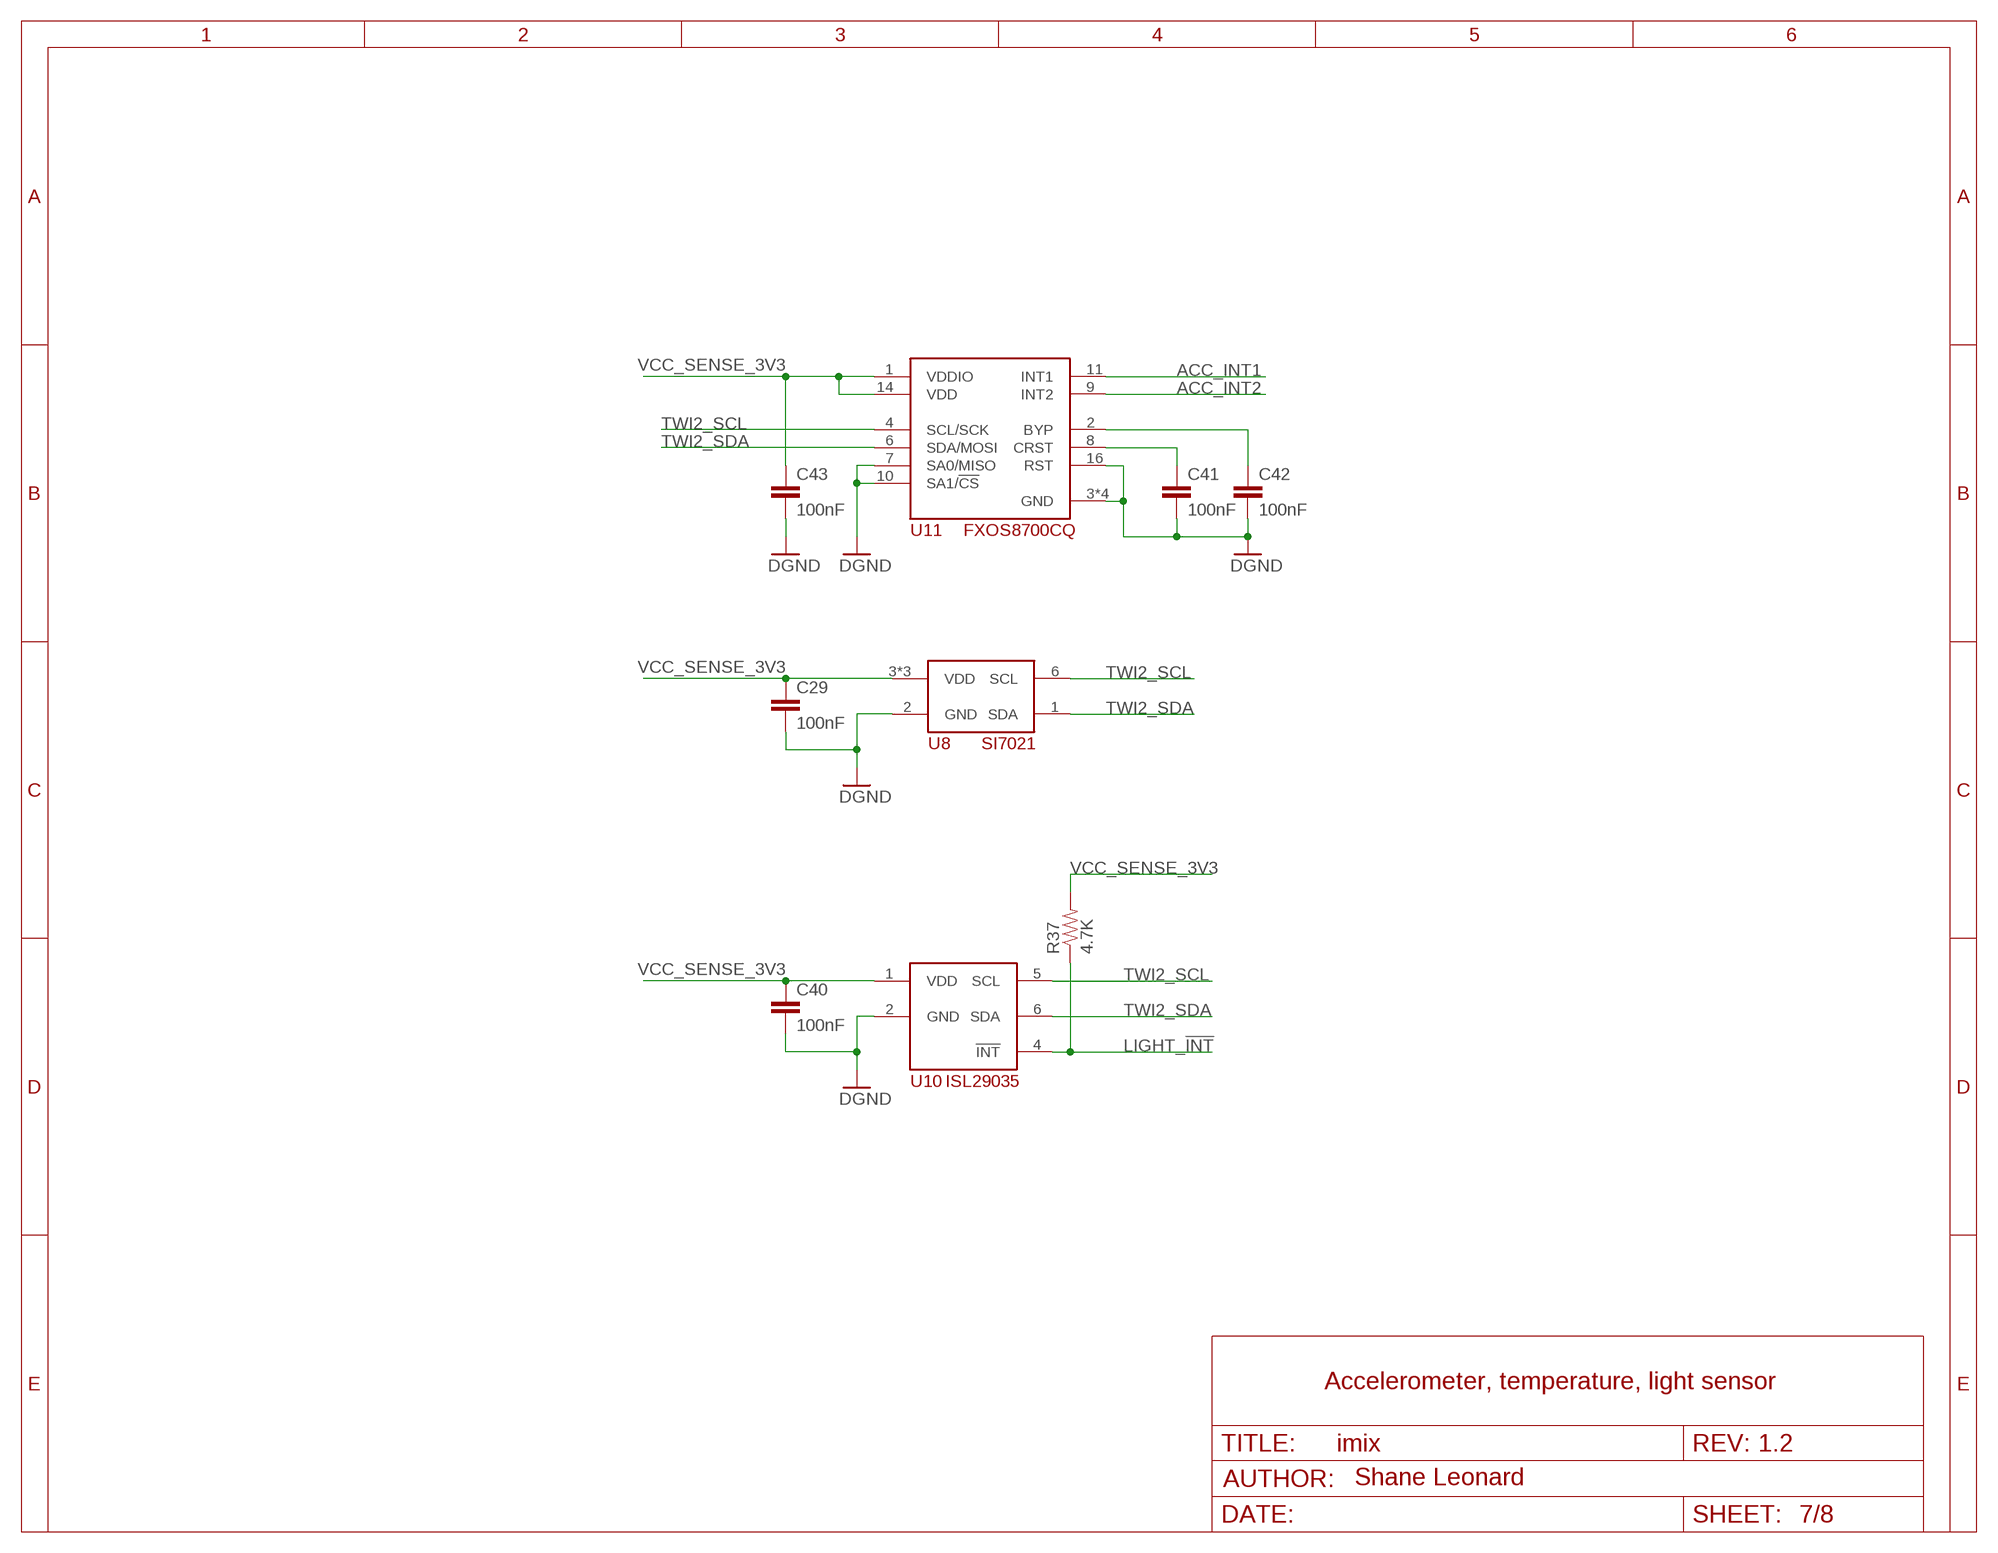
[diagram p6: schematic, sheet 7]

### Parts
C29  100nF  C-EUC0603  [C0603]
C40  100nF  C-EUC0603  [C0603]
C41  100nF  C-EUC0603  [C0603]
C42  100nF  C-EUC0603  [C0603]
C43  100nF  C-EUC0603  [C0603]
R37  4.7K  RESISTOR0603-RES  [0603-RES]
U8  SI7021  [SI7021]
U10  ISL29035  [ISL29035]
U11  FX0S8700CQ  [QFN16_3,5]

### Nets
ACC_INT1: U11.11(INT1) ; also sheet 1,2
ACC_INT2: U11.9(INT2) ; also sheet 1,2
GND: C29.2 C40.2 C41.2 C42.2 C43.2 U8.2(GND) U10.2(GND) U11.3(GND) U11.5(GND) U11.7(SA0/MISO) U11.10(SA1/!CS) U11.12(GND) U11.13(GND) U11.16(RST) ; supply symbol labelled DGND ; also sheet 1,2,3,4,5,6,8
LIGHT_!INT: R37.1 U10.4(!INT) ; also sheet 1,2
N$61: C41.1 U11.8(CRST)
N$62: C42.1 U11.2(BYP)
TWI2_SCL: U8.6(SCL) U10.5(SCL) U11.4(SCL/SCK) ; also sheet 1,2,4
TWI2_SDA: U8.1(SDA) U10.6(SDA) U11.6(SDA/MOSI) ; also sheet 1,2,4
VCC_SENSE_3V3 [power]: C29.1 C40.1 C43.1 R37.2 U8.3(VDD) U8.4(VDD) U8.5(VDD) U10.1(VDD) U11.1(VDDIO) U11.14(VDD) ; also sheet 1,6

## Sheet 8 of 8: RNG
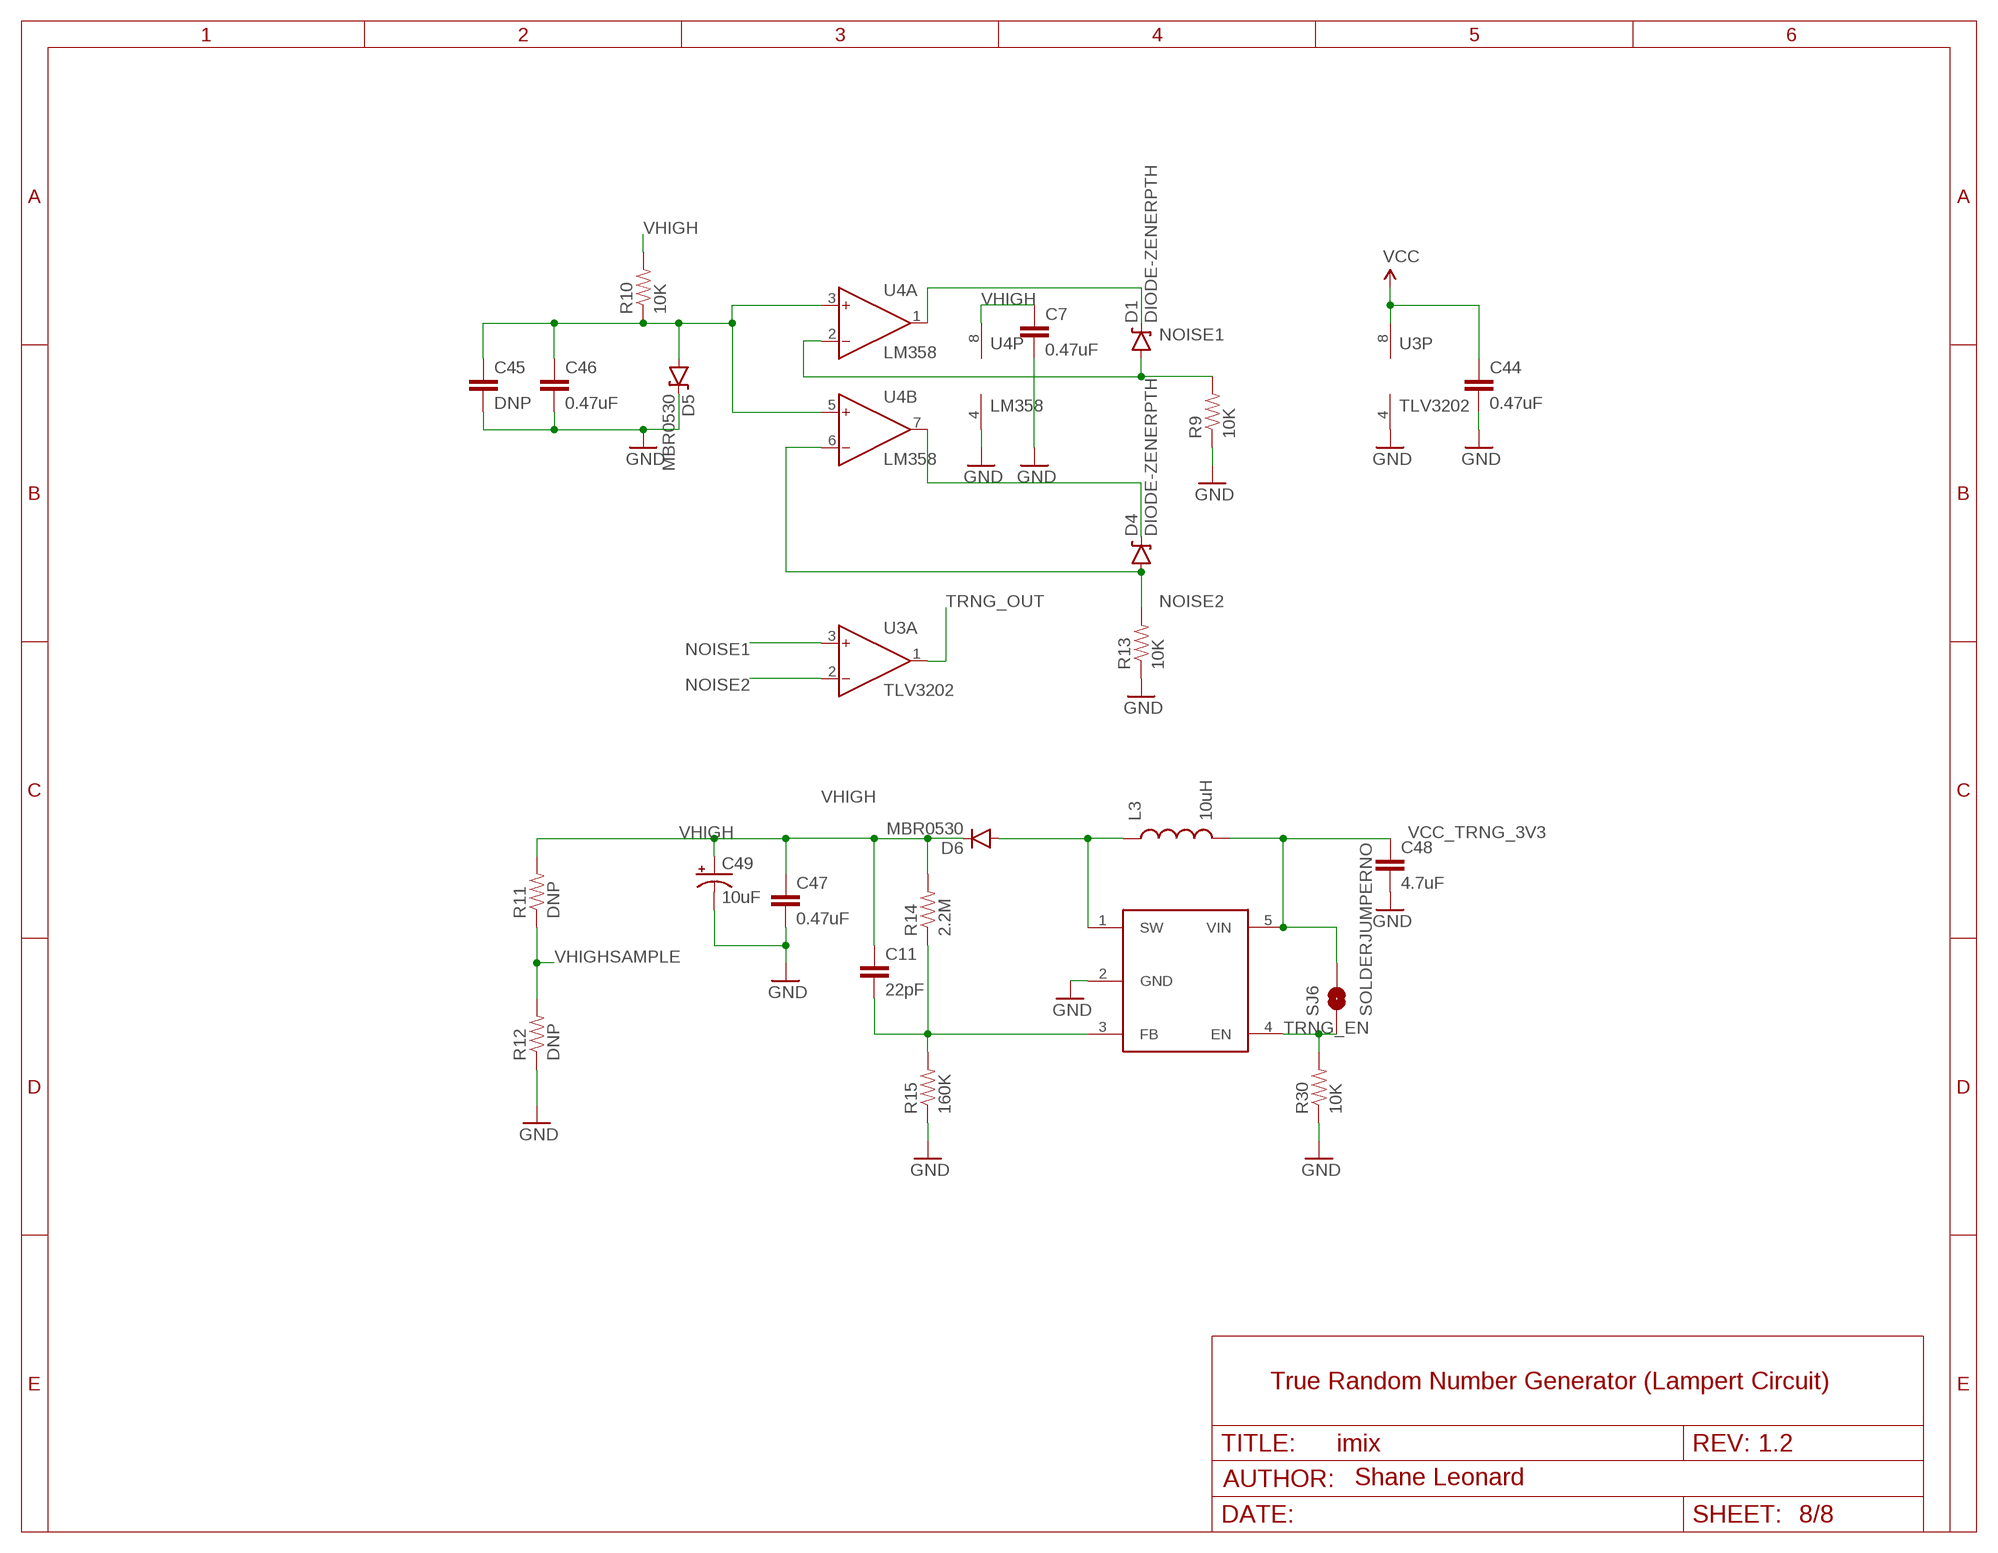
[diagram p7: schematic, sheet 8]

### Parts
C7  0.47uF  C-EUC0603  [C0603]
C11  22pF  C-EUC0603  [C0603]
C44  0.47uF  C-EUC0603  [C0603]
C45  DNP  C-EUC0603  [C0603]
C46  0.47uF  C-EUC0603  [C0603]
C47  0.47uF  C-EUC0603  [C0603]
C48  4.7uF  C-EUC0603  [C0603]
C49  10uF  CAP_POLC  [PANASONIC_C]
D1  DIODE-ZENERPTH  [DIODE-ZENER]
D4  DIODE-ZENERPTH  [DIODE-ZENER]
D5  MBR0530  DIODE-ZENER16V  [SOD-123]
D6  MBR0530  DIODESOD123  [SOD-123]
L3  10uH  INDUCTOR0805  [0805]
R9  10K  RESISTOR0603-RES  [0603-RES]
R10  10K  RESISTOR0603-RES  [0603-RES]
R11  DNP  RESISTOR0603-RES  [0603-RES]
R12  DNP  RESISTOR0603-RES  [0603-RES]
R13  10K  RESISTOR0603-RES  [0603-RES]
R14  2.2M  RESISTOR0603-RES  [0603-RES]
R15  160K  RESISTOR0603-RES  [0603-RES]
R30  10K  RESISTOR0603-RES  [0603-RES]
SJ6  SOLDERJUMPERNO  [SJ_2S-NO]
U3  TLV3202  AD712R  [SO8]
U4  LM358  AD712R  [SO8]
U12  296-12686-1-ND  TPS61040  [SOT23-5]

### Nets
GND: C7.2 C44.2 C45.2 C46.2 C47.2 C48.2 C49.- D5.C R9.1 R12.1 R13.1 R15.1 R30.1 U3.4(P:V-) U4.4(P:V-) U12.2(GND) ; also sheet 1,2,3,4,5,6,7
N$43: D6.A L3.1 U12.1(SW)
N$46: C11.2 R14.1 R15.2 U12.3(FB)
N$51: D1.P$1(C) U4.1(A:OUT)
N$52: D4.P$1(C) U4.7(B:OUT)
N$66: C45.1 C46.1 D5.A R10.1 U4.3(A:IN+) U4.5(B:IN+)
NOISE1: D1.P$2(A) R9.2 U3.3(A:IN+) U4.2(A:IN-)
NOISE2: D4.P$2(A) R13.2 U3.2(A:IN-) U4.6(B:IN-)
TRNG_EN: R30.2 SJ6.1 U12.4(EN) ; also sheet 1,2
TRNG_OUT: U3.1(A:OUT) ; also sheet 1,2
VCC_TRNG_3V3 [power]: C44.1 C48.1 L3.2 SJ6.2 U3.8(P:V+) U12.5(VIN) ; supply symbol labelled VCC ; also sheet 6
VHIGH: C7.1 C11.1 C47.1 C49.+ D6.C R10.2 R11.2 R14.2 U4.8(P:V+)
VHIGHSAMPLE: R11.1 R12.2
Unconnected: U3.5(B:IN+) U3.6(B:IN-) U3.7(B:OUT)

## Power pins joined to a net without a drawn wire
BIASH: U6.54(BIASH)
BIASL: U6.55(BIASL)

## Library data of the parts
B1 = stanford_iot_research:2450BM15A0015: Johanson Technology Balun, impedance matched for the AT86RF232 and AT86RF233 chipsets.
B2 = stanford_iot_research:BAL_NRF01D3
BAT1 = imix_v1:BATTERY: Battery Holders Various common sizes : AA, AAA, 18650 (PRT-12895), 20mm coin cell and 12mm coin cell. 20MM_4LEGS, BATT-10373
C1-C8 C11-C16 C18-C29 C31-C48 C50 = imix:C-EU: CAPACITOR, European symbol
C17 = rcl:C-EU: CAPACITOR, European symbol
C49 = imix:CAP_POL: Capacitor Polarized These are standard SMD and PTH capacitors. Normally 10uF, 47uF, and 100uF in electrolytic and tantalum varieties. Always verify the external diameter of the through hole cap, it varies with capacity, voltage, and manufacturer. The EIA devices should be standard.
D1 D4 = SparkFun-DiscreteSemi:DIODE-ZENER: Zener Diode Production Part - 8199 3.4V Zener Voltage; MPN: 610-1N759A
D2 D3 D9 = SparkFun-DiscreteSemi:BAT20JFILM: 23V, 1A Schottky diode, SOD-323 package; PROD_ID: DIO-11623; VALUE: BAT20JFILM
D5 = SparkFun-DiscreteSemi:DIODE-ZENER: Zener Diode Production Part - 8199 3.4V Zener Voltage; DKPN: MBR0530CT-ND; PROD_ID: DIO-12440; VALUE: 16V
D6 = imix_v1:DIODE: Diode These are standard reverse protection diodes and small signal diodes. SMA package can handle up to about 1A. SOD-323 can handle about 200mA. What the SOD-323 package when ordering, there are some mfgs out there that are 5-pin packages.; DKPN: MBR0530CT-ND
F1-F10 = GeekAmmo:FIDUCIAL
J1 = SparkFun-Connectors:M10X2: This was SPECIALLY designed to be used with our Graphic LCD Backpack. Be sure you want to use this! It is not only staggered on each line of header holes, but IT IS ALSO offset of the center point of the top and bottom lines by 5 mil. This causes the headers to lock into place on the "standard" footprint on the LCD screen. The extra squares on the tdocu layer are there simply to reference other pins (if you were to actually populate a longer header than ten long - this is what we do with the backpacks).
J2 = SparkFun-Connectors:M10: Header 10 Standard 10-pin 0.1" header. Use with straight break away headers (SKU : PRT-00116), right angle break away headers (PRT-00553), swiss pins (PRT-00743), machine pins (PRT-00117), and female headers (PRT-00115).; PROD_ID: CONN-11563
J2_3_5_AND_6 = imix:ARDUINO_R3: Arduino R3 Footprint (w/ SPI header)
J3 J5 = SparkFun-Connectors:M08: Header 8 Standard 8-pin 0.1" header. Use with straight break away headers (SKU : PRT-00116), right angle break away headers (PRT-00553), swiss pins (PRT-00743), machine pins (PRT-00117), and female headers (PRT-00115).; PROD_ID: CONN-08438
J4.1-J4.5 = SparkFun-Connectors:M02: Standard 2-pin 0.1" header. Use with - straight break away headers ( PRT-00116) - right angle break away headers (PRT-00553) - swiss pins (PRT-00743) - machine pins (PRT-00117) - female headers (PRT-00115) Molex polarized connector foot print use with: PRT-08233 with associated crimp pins and housings. 2.54_SCREWTERM for use with PRT-10571. 3.5mm Screw Terminal footprints for PRT-08084 5mm Screw Terminal footprints for use with PRT-08432
J6 = SparkFun-Connectors:M06: Header 6 Standard 6-pin 0.1" header. Use with straight break away headers (SKU : PRT-00116), right angle break away headers (PRT-00553), swiss pins (PRT-00743), machine pins (PRT-00117), and female headers (PRT-00115). Molex polarized connector foot print use with SKU : PRT-08094 with associated crimp pins and housings. NOTES ON THE VARIANTS LOCK and LOCK_LONGPADS... This footprint was designed to help hold the alignment of a through-hole component (i.e. 6-pin header) while soldering it into place. You may notice that each hole has been shifted either up or down by 0.005 of an inch from it's more standard position (which is a perfectly straight line). This slight alteration caused the pins (the squares in the middle) to touch the edges of the holes. Because they are alternating, it causes a "brace" to hold the component in place. 0.005 has proven to be the perfect amount of "off-center" position when using our standard breakaway headers. Although looks a little odd when you look at the bare footprint, once you have a header in there, the alteration is very hard to notice. Also,if you push a header all the way into place, it is covered up entirely on the bottom side. This idea of altering the position of holes to aid alignment will be further integrated into the Sparkfun Library for other footprints. It can help hold any component with 3 or more connection pins.; PROD_ID: CONN-08437
L1 L2 = stanford_iot_research:L: Inductor, American symbol.
L3 = SparkFun-Passives:INDUCTOR: Inductors Basic Inductor/Choke - 0603 and 1206. Footprints are not proven and vary greatly between part numbers. INDUCTOR POWER 3.3UH 4.0A SMD 0.197" L x 0.197" W x 0.177" H (5.00mm x 5.00mm x 4.50mm); DKPN: 587-2045-1-ND; MFPN: LBR2012T100K
LED2 LED4 LED5 = SparkFun-LED:LED-BLUE: Blue LEDs for production use Various blue LEDs stocked by SparkFun production 0603 - DIO-08575 Rebel - DIO-09553 1206 - DIO-09911; PROD_ID: DIO-08575; VALUE: BLUE
LED3 = SparkFun-LED:LED-GREEN: Various green LEDs Green LEDs used in SFE Production 0603- DIO-00821 LARGE- DIO-00862 LILYPAD- DIO-09910; PROD_ID: DIO-00821; VALUE: GREEN
Q2-Q5 = SparkFun-DiscreteSemi:MOSFET-PCHANNEL: Generic PMOSFET IRLML2244 - TRANS-11153 (SOT-23 -20V -4.3A) (1.Gate 2.Source 3.Drain) FQP27P06 - COM-10349 <http://www.sparkfun.com/products/10349> (TO-220 -60V -27A) (1.Gate 2.Source 3.Drain); PROD_ID: TRANS-11308; VALUE: 2.5A/30V
R1-R7 R9-R18 R20-R26 R28-R30 R33-R38 = imix:RESISTOR: Resistor Basic schematic elements and footprints for 0603, 1206, and PTH resistors.
RESET USER = SparkFun-Retired:TAC_SWITCH: Momentary Switch Button commonly used for reset or general input. Spark Fun Electronics SKU : COM-00097 SMT- SWCH-08247; PROD_ID: SWCH-08247; VALUE: TAC_SWITCHSMD
SJ1-SJ4 SJ7 = SparkFun-Passives:JUMPER-PAD-2-NC_BY_TRACE
SJ6 = SparkFun-Retired:SOLDERJUMPER: Solder Jumper Standard SMD solder jumper. Used to automate production. Two varients : Normally Open and Normally Closed are the same, but have different paste layers. NC will have a large amount of paste and should jumper during reflow.
TC1 TC2 = TagConnect:TC2030-IDC: Tag-Connect In Circuit Programming & Debug Cable 6 Pin http://www.tag-connect.com
U1 = imix:BQ2423X: TI bq2423x: USB-Friendly Lithium-Ion Battery Charger And Power-Path Management IC
U2 = stanford_iot_research:AT86RF233: AT86RF233 is a high performance RF-CMOS 2.4GHz radio transceiver targeted for IEEE® 802.15.4, ZigBee®, RF4CE, 6LoWPAN, and ISM applications. -40°C to +85°C (industry) and -40°C to +125°C (extended). 1.8 V to 3.6 V supply voltage with internal regulator.
U3 = analog-devices:AD712: Dual Precision, Low Cost, High Speed BiFET Op Amp Source: http://www.analog.com/static/imported-files/data_sheets/AD712.pdf; DKPN: 296-34773-1-ND; MF: ALTERA CORPORATION; MPN: AD712KRZ; OC_FARNELL: 1263975; OC_NEWARK: 59K4556
U4 = analog-devices:AD712: Dual Precision, Low Cost, High Speed BiFET Op Amp Source: http://www.analog.com/static/imported-files/data_sheets/AD712.pdf; MF: ALTERA CORPORATION; MPN: AD712KRZ; OC_FARNELL: 1263975; OC_NEWARK: 59K4556
U5 = SparkFun-PowerIC:LDO-TPS78233: Voltage Regulator LDO 500nA Ground Current, 150mA, Ultra-Low Quiescent Current Low-Dropout Linear Regulator.
U6 = imix:ATSAM4LCX_100: 100-pin TQFP Atmel SAM4LC microcontroller.
U7 = stanford_iot_research:FT231X: FT231X USB to serial converter.
U8 = imix:SI7021: SI7021 monolithic ambient humidity/temperature sensor from Silicon Labs.
U9 = imix:NRF51822: Nordic Semiconductor Bluetooth module nRF51822.
U10 = imix:ISL29035
U11 = imix:FX0S8700CQ: FXOS8700CQ accelerometer from NXP. 6-axis with linear accelerometer and magnetometer. Accelerometer is 14-bit resolution, magnetometer is 16-bit.
U12 = SparkFun-PowerIC:TPS61040: TPS61041 DC DC Custom; DKPN: 296-12686-1-ND
U$1 U$4 = inverted_f_antenna:INVERTED_F_ANTENNA: 2.4GHz Inverted F Antenna Based on TI Design Note DN007
USB1 USB2 = SparkFun-Connectors-Fixed:USB-AB: This is a USB AB connector that is compatible with USB OTG. i.e. this connector can serve as a host or device
X1-X3 = stanford_iot_research:XTAL_GROUNDED: Miscellaneous surface mount crystals.

## Net classes
0 default: width 0.152 mm, drill 0.33 mm, clearance 0.152 mm
1 power: width 0.152 mm, drill 0.33 mm, clearance 0.254 mm
2 50ohm: width 0.152 mm, drill 0.33 mm, clearance 0.254 mm